# Altium project S7CAS-PLEIADES-CARTES-MERE_P07.PrjPcb (part 3 of 4)

## Sheet S7CAS-PLEIADES-CARTE-MERE_P07_DDR.SchDoc
size Tabloid; DocumentNumber: 11; SheetNumber: 11; SheetTotal: 16; Sheet_Name: DDR; Size: 11x17
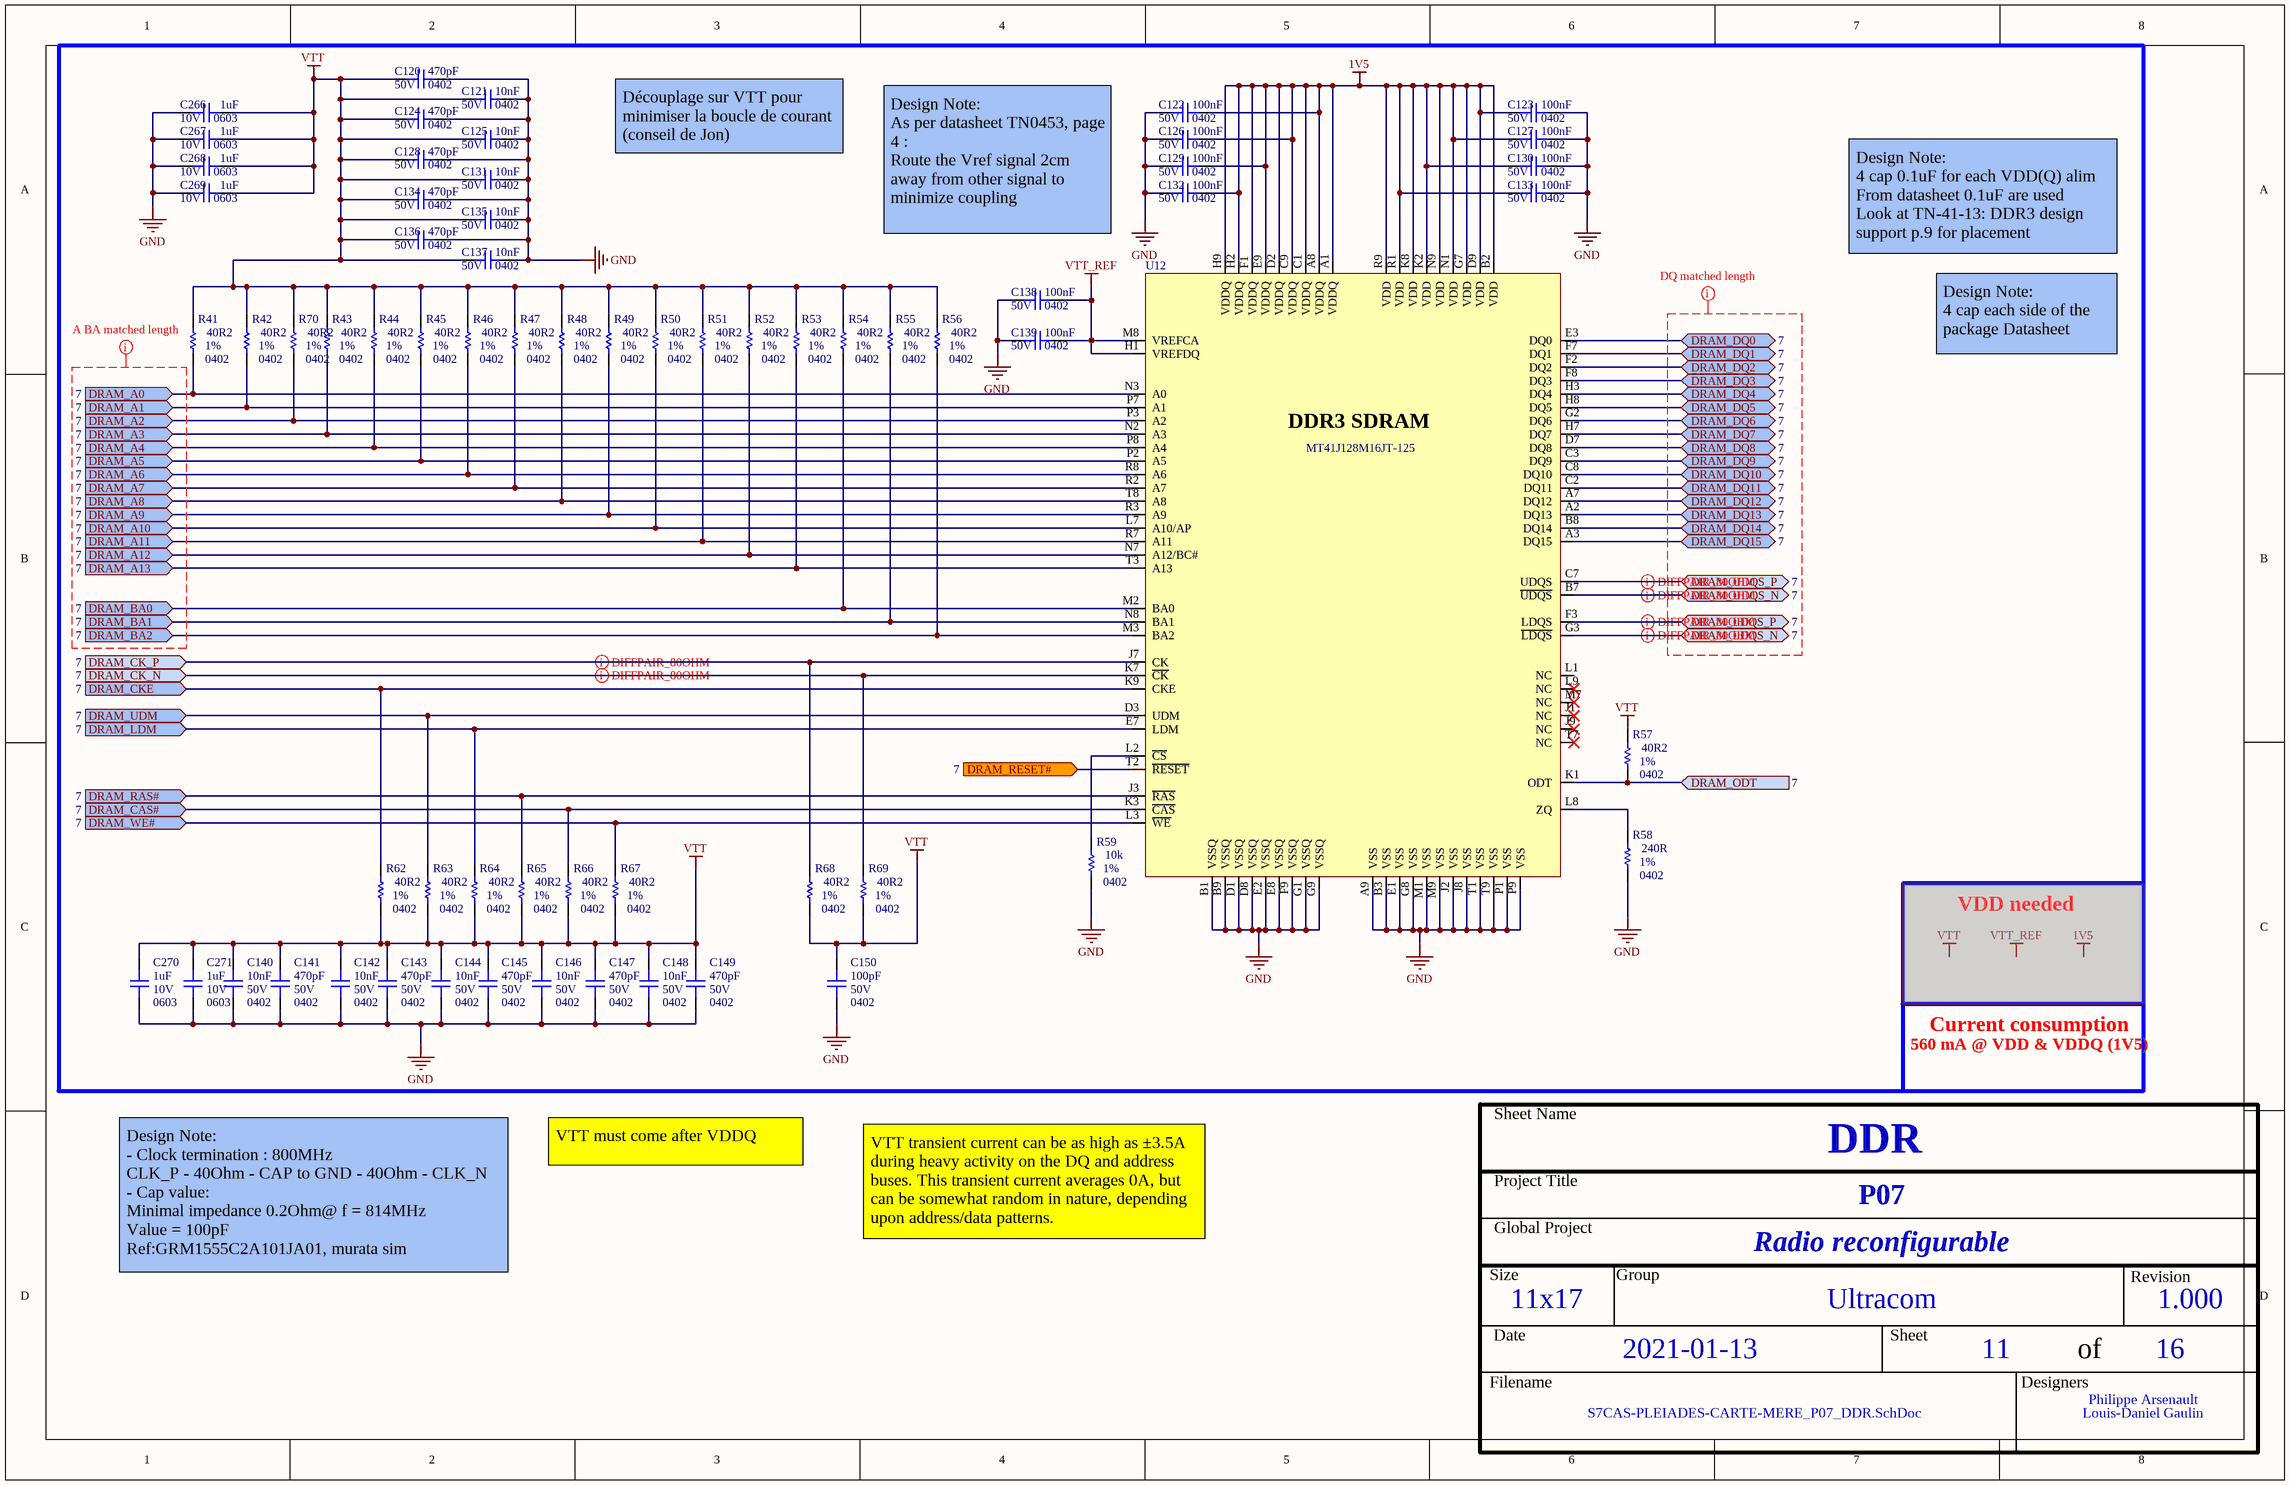
[diagram p10: S7CAS-PLEIADES-CARTE-MERE_P07_DDR.SchDoc]

### Parts
C120  value 470pF  Voltage: 50V  Package: 0402  [CAP_0402]  (hidden comment: CAP - 0402)
C121  value 10nF  Voltage: 50V  Package: 0402  [CAP_0402]  (hidden comment: CAP - 0402)
C122  value 100nF  Voltage: 50V  Package: 0402  [CAP_0402]  (hidden comment: CAP - 0402)
C123  value 100nF  Voltage: 50V  Package: 0402  [CAP_0402]  (hidden comment: CAP - 0402)
C124  value 470pF  Voltage: 50V  Package: 0402  [CAP_0402]  (hidden comment: CAP - 0402)
C125  value 10nF  Voltage: 50V  Package: 0402  [CAP_0402]  (hidden comment: CAP - 0402)
C126  value 100nF  Voltage: 50V  Package: 0402  [CAP_0402]  (hidden comment: CAP - 0402)
C127  value 100nF  Voltage: 50V  Package: 0402  [CAP_0402]  (hidden comment: CAP - 0402)
C128  value 470pF  Voltage: 50V  Package: 0402  [CAP_0402]  (hidden comment: CAP - 0402)
C129  value 100nF  Voltage: 50V  Package: 0402  [CAP_0402]  (hidden comment: CAP - 0402)
C130  value 100nF  Voltage: 50V  Package: 0402  [CAP_0402]  (hidden comment: CAP - 0402)
C131  value 10nF  Voltage: 50V  Package: 0402  [CAP_0402]  (hidden comment: CAP - 0402)
C132  value 100nF  Voltage: 50V  Package: 0402  [CAP_0402]  (hidden comment: CAP - 0402)
C133  value 100nF  Voltage: 50V  Package: 0402  [CAP_0402]  (hidden comment: CAP - 0402)
C134  value 470pF  Voltage: 50V  Package: 0402  [CAP_0402]  (hidden comment: CAP - 0402)
C135  value 10nF  Voltage: 50V  Package: 0402  [CAP_0402]  (hidden comment: CAP - 0402)
C136  value 470pF  Voltage: 50V  Package: 0402  [CAP_0402]  (hidden comment: CAP - 0402)
C137  value 10nF  Voltage: 50V  Package: 0402  [CAP_0402]  (hidden comment: CAP - 0402)
C138  value 100nF  Voltage: 50V  Package: 0402  [CAP_0402]  (hidden comment: CAP - 0402)
C139  value 100nF  Voltage: 50V  Package: 0402  [CAP_0402]  (hidden comment: CAP - 0402)
C140  value 10nF  Voltage: 50V  Package: 0402  [CAP_0402]  (hidden comment: CAP - 0402)
C141  value 470pF  Voltage: 50V  Package: 0402  [CAP_0402]  (hidden comment: CAP - 0402)
C142  value 10nF  Voltage: 50V  Package: 0402  [CAP_0402]  (hidden comment: CAP - 0402)
C143  value 470pF  Voltage: 50V  Package: 0402  [CAP_0402]  (hidden comment: CAP - 0402)
C144  value 10nF  Voltage: 50V  Package: 0402  [CAP_0402]  (hidden comment: CAP - 0402)
C145  value 470pF  Voltage: 50V  Package: 0402  [CAP_0402]  (hidden comment: CAP - 0402)
C146  value 10nF  Voltage: 50V  Package: 0402  [CAP_0402]  (hidden comment: CAP - 0402)
C147  value 470pF  Voltage: 50V  Package: 0402  [CAP_0402]  (hidden comment: CAP - 0402)
C148  value 10nF  Voltage: 50V  Package: 0402  [CAP_0402]  (hidden comment: CAP - 0402)
C149  value 470pF  Voltage: 50V  Package: 0402  [CAP_0402]  (hidden comment: CAP - 0402)
C150  value 100pF  Voltage: 50V  Package: 0402  [CAP_0402]  (hidden comment: CAP - 0402)
C266  value 1uF  Voltage: 10V  Package: 0603  [CAP_0603]  (hidden comment: CAP - 0603)
C267  value 1uF  Voltage: 10V  Package: 0603  [CAP_0603]  (hidden comment: CAP - 0603)
C268  value 1uF  Voltage: 10V  Package: 0603  [CAP_0603]  (hidden comment: CAP - 0603)
C269  value 1uF  Voltage: 10V  Package: 0603  [CAP_0603]  (hidden comment: CAP - 0603)
C270  value 1uF  Voltage: 10V  Package: 0603  [CAP_0603]  (hidden comment: CAP - 0603)
C271  value 1uF  Voltage: 10V  Package: 0603  [CAP_0603]  (hidden comment: CAP - 0603)
R41  value 40R2  Package: 0402  Precision: 1%  [RES_0402]  (hidden comment: RES - 0402)
R42  value 40R2  Package: 0402  Precision: 1%  [RES_0402]  (hidden comment: RES - 0402)
R43  value 40R2  Package: 0402  Precision: 1%  [RES_0402]  (hidden comment: RES - 0402)
R44  value 40R2  Package: 0402  Precision: 1%  [RES_0402]  (hidden comment: RES - 0402)
R45  value 40R2  Package: 0402  Precision: 1%  [RES_0402]  (hidden comment: RES - 0402)
R46  value 40R2  Package: 0402  Precision: 1%  [RES_0402]  (hidden comment: RES - 0402)
R47  value 40R2  Package: 0402  Precision: 1%  [RES_0402]  (hidden comment: RES - 0402)
R48  value 40R2  Package: 0402  Precision: 1%  [RES_0402]  (hidden comment: RES - 0402)
R49  value 40R2  Package: 0402  Precision: 1%  [RES_0402]  (hidden comment: RES - 0402)
R50  value 40R2  Package: 0402  Precision: 1%  [RES_0402]  (hidden comment: RES - 0402)
R51  value 40R2  Package: 0402  Precision: 1%  [RES_0402]  (hidden comment: RES - 0402)
R52  value 40R2  Package: 0402  Precision: 1%  [RES_0402]  (hidden comment: RES - 0402)
R53  value 40R2  Package: 0402  Precision: 1%  [RES_0402]  (hidden comment: RES - 0402)
R54  value 40R2  Package: 0402  Precision: 1%  [RES_0402]  (hidden comment: RES - 0402)
R55  value 40R2  Package: 0402  Precision: 1%  [RES_0402]  (hidden comment: RES - 0402)
R56  value 40R2  Package: 0402  Precision: 1%  [RES_0402]  (hidden comment: RES - 0402)
R57  value 40R2  Package: 0402  Precision: 1%  [RES_0402]  (hidden comment: RES - 0402)
R58  value 240R  Package: 0402  Precision: 1%  [RES_0402]  (hidden comment: RES - 0402)
R59  value 10k  Package: 0402  Precision: 1%  [RES_0402]  (hidden comment: RES - 0402)
R62  value 40R2  Package: 0402  Precision: 1%  [RES_0402]  (hidden comment: RES - 0402)
R63  value 40R2  Package: 0402  Precision: 1%  [RES_0402]  (hidden comment: RES - 0402)
R64  value 40R2  Package: 0402  Precision: 1%  [RES_0402]  (hidden comment: RES - 0402)
R65  value 40R2  Package: 0402  Precision: 1%  [RES_0402]  (hidden comment: RES - 0402)
R66  value 40R2  Package: 0402  Precision: 1%  [RES_0402]  (hidden comment: RES - 0402)
R67  value 40R2  Package: 0402  Precision: 1%  [RES_0402]  (hidden comment: RES - 0402)
R68  value 40R2  Package: 0402  Precision: 1%  [RES_0402]  (hidden comment: RES - 0402)
R69  value 40R2  Package: 0402  Precision: 1%  [RES_0402]  (hidden comment: RES - 0402)
R70  value 40R2  Package: 0402  Precision: 1%  [RES_0402]  (hidden comment: RES - 0402)
U12  MT41J128M16JT-125  [MEM_DDR3_MT41J128M16JT-125]

### Ports
DRAM_A0 (in, see 7), DRAM_A1 (in, see 7), DRAM_A2 (in, see 7), DRAM_A3 (in, see 7), DRAM_A4 (in, see 7), DRAM_A5 (in, see 7), DRAM_A6 (in, see 7), DRAM_A7 (in, see 7), DRAM_A8 (in, see 7), DRAM_A9 (in, see 7), DRAM_A10 (in, see 7), DRAM_A11 (in, see 7), DRAM_A12 (in, see 7), DRAM_A13 (in, see 7), DRAM_BA0 (in, see 7), DRAM_BA1 (in, see 7), DRAM_BA2 (in, see 7), DRAM_CAS# (in, see 7), DRAM_CK_N (in, see 7), DRAM_CK_P (in, see 7), DRAM_CKE (in, see 7), DRAM_DQ0 (bidir, see 7), DRAM_DQ1 (bidir, see 7), DRAM_DQ2 (bidir, see 7), DRAM_DQ3 (bidir, see 7), DRAM_DQ4 (bidir, see 7), DRAM_DQ5 (bidir, see 7), DRAM_DQ6 (bidir, see 7), DRAM_DQ7 (bidir, see 7), DRAM_DQ8 (bidir, see 7), DRAM_DQ9 (bidir, see 7), DRAM_DQ10 (bidir, see 7), DRAM_DQ11 (bidir, see 7), DRAM_DQ12 (bidir, see 7), DRAM_DQ13 (bidir, see 7), DRAM_DQ14 (bidir, see 7), DRAM_DQ15 (bidir, see 7), DRAM_LDM (in, see 7), DRAM_LDQS_N (bidir, see 7), DRAM_LDQS_P (bidir, see 7), DRAM_ODT (in, see 7), DRAM_RAS# (in, see 7), DRAM_RESET# (in, see 7), DRAM_UDM (in, see 7), DRAM_UDQS_N (bidir, see 7), DRAM_UDQS_P (bidir, see 7), DRAM_WE# (in, see 7)

### Nets
1V5: C122.1 C123.2 C126.1 C127.2 C129.1 C130.2 C132.1 C133.2 U12.A1(VDDQ) U12.A8(VDDQ) U12.B2(VDD) U12.C1(VDDQ) U12.C9(VDDQ) U12.D2(VDDQ) U12.D9(VDD) U12.E9(VDDQ) U12.F1(VDDQ) U12.G7(VDD) U12.H2(VDDQ) U12.H9(VDDQ) U12.K2(VDD) U12.K8(VDD) U12.N1(VDD) U12.N9(VDD) U12.R1(VDD) U12.R9(VDD)
GND: C120.1 C121.1 C122.2 C123.1 C124.1 C125.1 C126.2 C127.1 C128.1 C129.2 C130.1 C131.1 C132.2 C133.1 C134.1 C135.1 C136.1 C137.1 C138.2 C139.2 C140.1 C141.1 C142.1 C143.1 C144.1 C145.1 C146.1 C147.1 C148.1 C149.1 C150.1 C266.2 C267.2 C268.2 C269.2 C270.1 C271.1 R58.1 R59.1 U12.A9(VSS) U12.B1(VSSQ) U12.B3(VSS) U12.B9(VSSQ) U12.D1(VSSQ) U12.D8(VSSQ) U12.E1(VSS) U12.E2(VSSQ) U12.E8(VSSQ) U12.F9(VSSQ) U12.G1(VSSQ) U12.G8(VSS) U12.G9(VSSQ) U12.J2(VSS) U12.J8(VSS) U12.M1(VSS) U12.M9(VSS) U12.P1(VSS) U12.P9(VSS) U12.T1(VSS) U12.T9(VSS)
VTT: C120.2 C121.2 C124.2 C125.2 C128.2 C131.2 C134.2 C135.2 C136.2 C137.2 C140.2 C141.2 C142.2 C143.2 C144.2 C145.2 C146.2 C147.2 C148.2 C149.2 C150.2 C266.1 C267.1 C268.1 C269.1 C270.2 C271.2 R41.2 R42.2 R43.2 R44.2 R45.2 R46.2 R47.2 R48.2 R49.2 R50.2 R51.2 R52.2 R53.2 R54.2 R55.2 R56.2 R57.2 R62.1 R63.1 R64.1 R65.1 R66.1 R67.1 R68.1 R69.1 R70.2
VTT_REF: C138.1 C139.1 U12.H1(VREFDQ) U12.M8(VREFCA)
DRAM_A0: R41.1 U12.N3(A0) ; port DRAM_A0
DRAM_A1: R42.1 U12.P7(A1) ; port DRAM_A1
DRAM_A2: R70.1 U12.P3(A2) ; port DRAM_A2
DRAM_A3: R43.1 U12.N2(A3) ; port DRAM_A3
DRAM_A4: R44.1 U12.P8(A4) ; port DRAM_A4
DRAM_A5: R45.1 U12.P2(A5) ; port DRAM_A5
DRAM_A6: R46.1 U12.R8(A6) ; port DRAM_A6
DRAM_A7: R47.1 U12.R2(A7) ; port DRAM_A7
DRAM_A8: R48.1 U12.T8(A8) ; port DRAM_A8
DRAM_A9: R49.1 U12.R3(A9) ; port DRAM_A9
DRAM_A10: R50.1 U12.L7(A10/AP) ; port DRAM_A10
DRAM_A11: R51.1 U12.R7(A11) ; port DRAM_A11
DRAM_A12: R52.1 U12.N7(A12/BC#) ; port DRAM_A12
DRAM_A13: R53.1 U12.T3(A13) ; port DRAM_A13
DRAM_BA0: R54.1 U12.M2(BA0) ; port DRAM_BA0
DRAM_BA1: R55.1 U12.N8(BA1) ; port DRAM_BA1
DRAM_BA2: R56.1 U12.M3(BA2) ; port DRAM_BA2
DRAM_CAS#: R66.2 U12.K3(~{CAS}) ; port DRAM_CAS#
DRAM_CK_N: R69.2 U12.K7(~{CK}) ; port DRAM_CK_N
DRAM_CK_P: R68.2 U12.J7(CK) ; port DRAM_CK_P
DRAM_CKE: R62.2 U12.K9(CKE) ; port DRAM_CKE
DRAM_DQ0: U12.E3(DQ0) ; port DRAM_DQ0
DRAM_DQ1: U12.F7(DQ1) ; port DRAM_DQ1
DRAM_DQ2: U12.F2(DQ2) ; port DRAM_DQ2
DRAM_DQ3: U12.F8(DQ3) ; port DRAM_DQ3
DRAM_DQ4: U12.H3(DQ4) ; port DRAM_DQ4
DRAM_DQ5: U12.H8(DQ5) ; port DRAM_DQ5
DRAM_DQ6: U12.G2(DQ6) ; port DRAM_DQ6
DRAM_DQ7: U12.H7(DQ7) ; port DRAM_DQ7
DRAM_DQ8: U12.D7(DQ8) ; port DRAM_DQ8
DRAM_DQ9: U12.C3(DQ9) ; port DRAM_DQ9
DRAM_DQ10: U12.C8(DQ10) ; port DRAM_DQ10
DRAM_DQ11: U12.C2(DQ11) ; port DRAM_DQ11
DRAM_DQ12: U12.A7(DQ12) ; port DRAM_DQ12
DRAM_DQ13: U12.A2(DQ13) ; port DRAM_DQ13
DRAM_DQ14: U12.B8(DQ14) ; port DRAM_DQ14
DRAM_DQ15: U12.A3(DQ15) ; port DRAM_DQ15
DRAM_LDM: R64.2 U12.E7(LDM) ; port DRAM_LDM
DRAM_LDQS_N: U12.G3(~{LDQS}) ; port DRAM_LDQS_N
DRAM_LDQS_P: U12.F3(LDQS) ; port DRAM_LDQS_P
DRAM_ODT: R57.1 U12.K1(ODT) ; port DRAM_ODT
DRAM_RAS#: R65.2 U12.J3(~{RAS}) ; port DRAM_RAS#
DRAM_RESET#: U12.T2(~{RESET}) ; port DRAM_RESET#
DRAM_UDM: R63.2 U12.D3(UDM) ; port DRAM_UDM
DRAM_UDQS_N: U12.B7(~{UDQS}) ; port DRAM_UDQS_N
DRAM_UDQS_P: U12.C7(UDQS) ; port DRAM_UDQS_P
DRAM_WE#: R67.2 U12.L3(~{WE}) ; port DRAM_WE#
NetR58_2: R58.2 U12.L8(ZQ)
NetR59_2: R59.2 U12.L2(~{CS})

Not connected (* = marked no-connect by the designer): U12 J1(NC)* J9(NC)* L1(NC) L9(NC)* M7(NC)* T7(NC)*

### Layout directives
differential pair; differential pair class DIFF_80_OHM: DRAM_CK_N, DRAM_CK_P, DRAM_LDQS_N, DRAM_LDQS_P, DRAM_UDQS_N, DRAM_UDQS_P
rule Matched Net Lengths [Tolerance = 1mil]; net class DDR_DQ: (no net found under the mark)
rule Matched Net Lengths [Tolerance = 1mil]; net class DDR_ADDR: (no net found under the mark)

### Notes on the sheet
- Découplage sur VTT pour minimiser la boucle de courant (conseil de Jon)
- Design Note:
  As per datasheet TN0453, page 4 :
  Route the Vref signal 2cm away from other signal to minimize coupling
- Design Note:
  4 cap 0.1uF for each VDD(Q) alim
  From datasheet 0.1uF are used
  Look at TN-41-13: DDR3 design support p.9 for placement
- Design Note:
  4 cap each side of the package Datasheet
- VDD needed
- Current consumption
- 560 mA @ VDD & VDDQ (1V5)
- VTT must come after VDDQ
- VTT transient current can be as high as ±3.5A during heavy activity on the DQ and address buses. This transient current averages 0A, but can be somewhat random in nature, depending upon address/data patterns.
- Design Note:
  - Clock termination : 800MHz
  CLK_P - 40Ohm - CAP to GND - 40Ohm - CLK_N
  - Cap value:
  Minimal impedance 0.2Ohm@ f = 814MHz
  Value = 100pF
  Ref:GRM1555C2A101JA01, murata sim
- Sheet Name
- Project Title
- Global Project
- Size
- Group
- Revision
- Date
- Sheet
- of
- Filename
- Designers
- (in symbol MEM_DDR3_MT41J128M16JT-125:K TR) DDR3 SDRAM

### Library data of the parts
C120-C150 = CAP - 0402: Precision: 10%; Current: *; CreatedBy: Jonathan Bouchard; Power: *
C266-C271 = CAP - 0603: Precision: 10%; Current: *; CreatedBy: Jonathan Bouchard; Power: *
R41-R59 R62-R70 = RES - 0402: Voltage: 50V; Power: 1/16W; Current: *; CreatedBy: Jonathan Bouchard
U12 = MEM_DDR3_MT41J128M16JT-125:K TR: MEM - DDR3 SDRAM 2GBIT 800MHZ - TFBGA-96; Voltage: 1.425 V ~ 1.575 V; Mfg: Micrel; Current: *; Power: *; Mfg Part Number: http://www.micron.com/~/media/Documents/Products/Data%20Sheet/DRAM/DDR3/2Gb_DDR3_SDRAM.pdf; HelpURL: http://ww1.microchip.com/downloads/en/DeviceDoc/00002275A.pdf; CreatedBy: Jonathan Bouchard; Temperature: 0°C ~ 95°C (TC); Value: *; Precision: *; Package: TFBGA-96; Supplier 1: Digikey; Supplier Part Number 1: 557-1611-1-ND

## Sheet S7CAS-PLEIADES-CARTE-MERE_P07_USB.SchDoc
size Tabloid; DocumentNumber: 12; SheetNumber: 12; SheetTotal: 16; Sheet_Name: USB; Size: 11x17
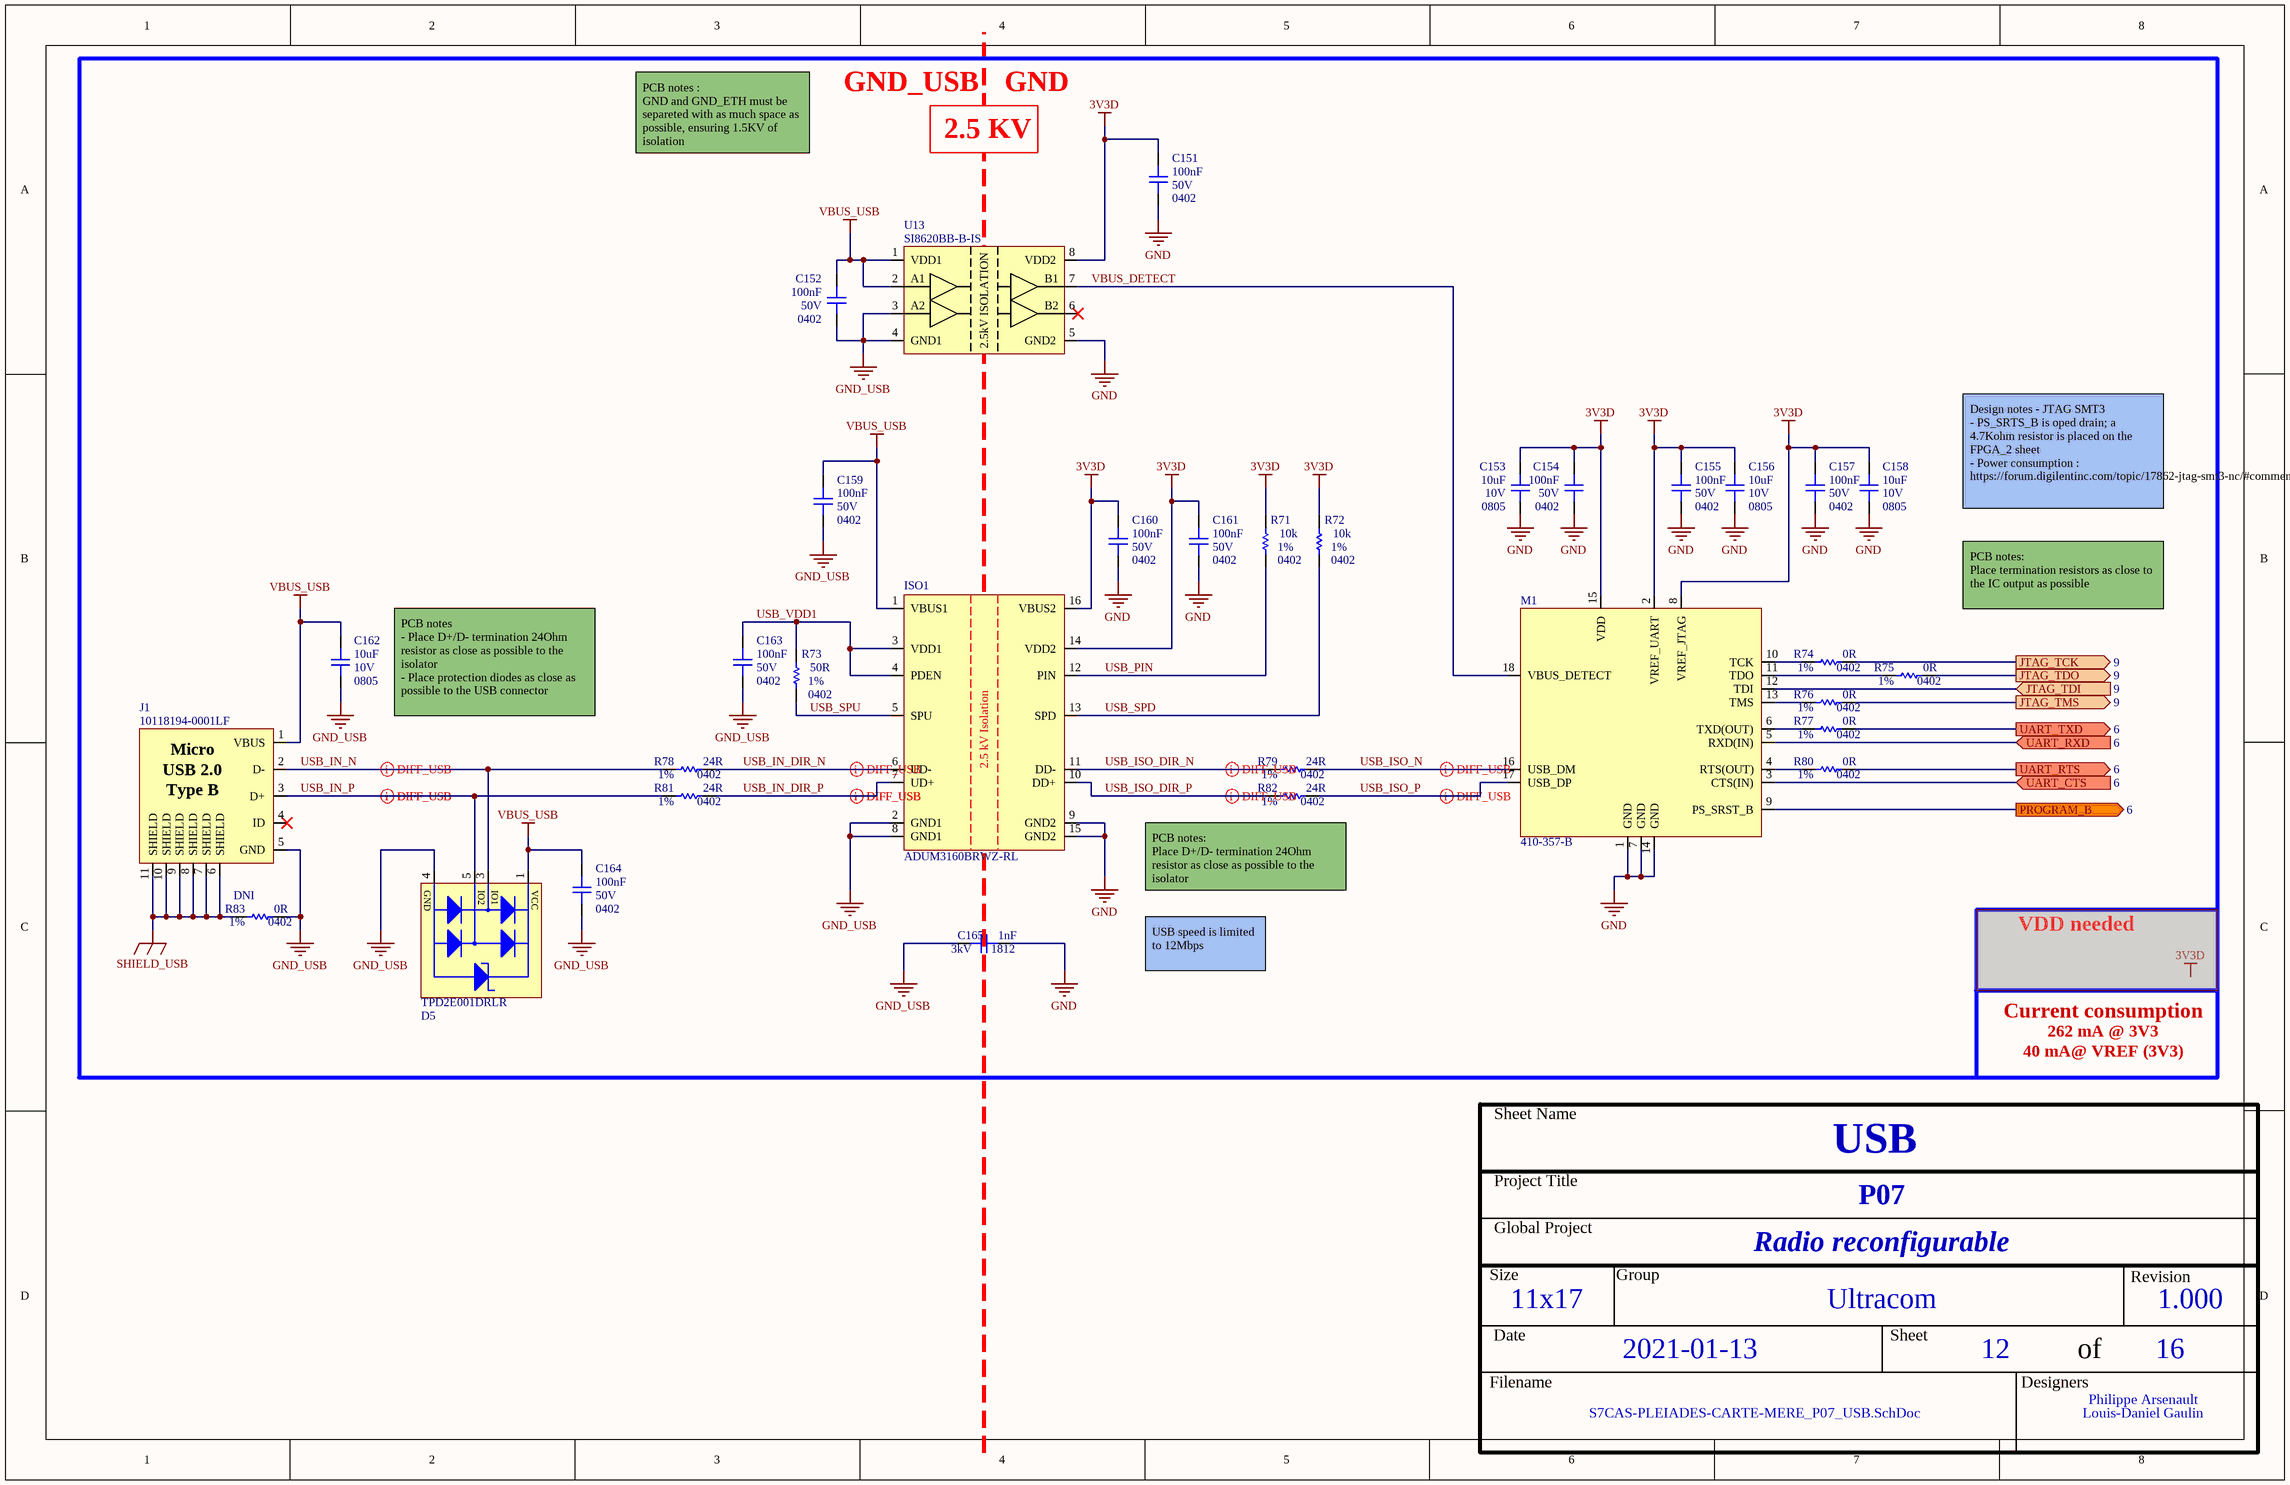
[diagram p11: S7CAS-PLEIADES-CARTE-MERE_P07_USB.SchDoc]

### Parts
C151  value 100nF  Voltage: 50V  Package: 0402  [CAP_0402]  (hidden comment: CAP - 0402)
C152  value 100nF  Voltage: 50V  Package: 0402  [CAP_0402]  (hidden comment: CAP - 0402)
C153  value 10uF  Voltage: 10V  Package: 0805  [CAP_0805]  (hidden comment: CAP - 0805)
C154  value 100nF  Voltage: 50V  Package: 0402  [CAP_0402]  (hidden comment: CAP - 0402)
C155  value 100nF  Voltage: 50V  Package: 0402  [CAP_0402]  (hidden comment: CAP - 0402)
C156  value 10uF  Voltage: 10V  Package: 0805  [CAP_0805]  (hidden comment: CAP - 0805)
C157  value 100nF  Voltage: 50V  Package: 0402  [CAP_0402]  (hidden comment: CAP - 0402)
C158  value 10uF  Voltage: 10V  Package: 0805  [CAP_0805]  (hidden comment: CAP - 0805)
C159  value 100nF  Voltage: 50V  Package: 0402  [CAP_0402]  (hidden comment: CAP - 0402)
C160  value 100nF  Voltage: 50V  Package: 0402  [CAP_0402]  (hidden comment: CAP - 0402)
C161  value 100nF  Voltage: 50V  Package: 0402  [CAP_0402]  (hidden comment: CAP - 0402)
C162  value 10uF  Voltage: 10V  Package: 0805  [CAP_0805]  (hidden comment: CAP - 0805)
C163  value 100nF  Voltage: 50V  Package: 0402  [CAP_0402]  (hidden comment: CAP - 0402)
C164  value 100nF  Voltage: 50V  Package: 0402  [CAP_0402]  (hidden comment: CAP - 0402)
C165  value 1nF  Voltage: 3kV  Package: 1812  [CAP_1812]  (hidden comment: CAP - 1812)
D5  TPD2E001DRLR  [TVS_USB_TPD2E001DRLR]
ISO1  ADUM3160BRWZ-RL  [ISO_ADUM3160BRWZ-RL]
J1  10118194-0001LF  [CON_USB_10118194-0001LF]
M1  410-357-B  [MOD_JTAG_410-357-B]
R71  value 10k  Package: 0402  Precision: 1%  [RES_0402]  (hidden comment: RES - 0402)
R72  value 10k  Package: 0402  Precision: 1%  [RES_0402]  (hidden comment: RES - 0402)
R73  value 50R  Package: 0402  Precision: 1%  [RES_0402]  (hidden comment: RES - 0402)
R74  value 0R  Package: 0402  Precision: 1%  [RES_0402]  (hidden comment: RES - 0402)
R75  value 0R  Package: 0402  Precision: 1%  [RES_0402]  (hidden comment: RES - 0402)
R76  value 0R  Package: 0402  Precision: 1%  [RES_0402]  (hidden comment: RES - 0402)
R77  value 0R  Package: 0402  Precision: 1%  [RES_0402]  (hidden comment: RES - 0402)
R78  value 24R  Package: 0402  Precision: 1%  [RES_0402]  (hidden comment: RES - 0402)
R79  value 24R  Package: 0402  Precision: 1%  [RES_0402]  (hidden comment: RES - 0402)
R80  value 0R  Package: 0402  Precision: 1%  [RES_0402]  (hidden comment: RES - 0402)
R81  value 24R  Package: 0402  Precision: 1%  [RES_0402]  (hidden comment: RES - 0402)
R82  value 24R  Package: 0402  Precision: 1%  [RES_0402]  (hidden comment: RES - 0402)
R83  value 0R  Package: 0402  Precision: 1%  Assembly note: DNI  [RES_0402]  (hidden comment: RES - 0402)
U13  SI8620BB-B-IS  [ISO_SI8620BB-B-IS]

### Ports
JTAG_TCK (out, see 9), JTAG_TDI (in, see 9), JTAG_TDO (out, see 9), JTAG_TMS (out, see 9), PROGRAM_B (out, see 6), UART_CTS (in, see 6), UART_RTS (out, see 6), UART_RXD (in, see 6), UART_TXD (out, see 6)

### Nets
3V3D: C151.2 C153.2 C154.2 C155.2 C156.2 C157.2 C158.2 C160.2 C161.2 ISO1.14(VDD2) ISO1.16(VBUS2) M1.2(VREF_UART) M1.8(VREF_JTAG) M1.15(VDD) R71.2 R72.2 U13.8(VDD2)
GND: C151.1 C153.1 C154.1 C155.1 C156.1 C157.1 C158.1 C160.1 C161.1 C165.1 ISO1.9(GND2) ISO1.15(GND2) M1.1(GND) M1.7(GND) M1.14(GND) U13.5(GND2)
GND_USB: C152.1 C159.1 C162.1 C163.1 C164.1 C165.2 D5.4(GND) ISO1.2(GND1) ISO1.8(GND1) J1.5(GND) R83.1 U13.3(A2) U13.4(GND1)
SHIELD_USB: J1.6(SHIELD) J1.7(SHIELD) J1.8(SHIELD) J1.9(SHIELD) J1.10(SHIELD) J1.11(SHIELD) R83.2
VBUS_USB: C152.2 C159.2 C162.2 C164.2 D5.1(VCC) ISO1.1(VBUS1) J1.1(VBUS) U13.1(VDD1) U13.2(A1)
JTAG_TCK: R74.1 ; port JTAG_TCK
JTAG_TDI: M1.12(TDI) ; port JTAG_TDI
JTAG_TDO: R75.1 ; port JTAG_TDO
JTAG_TMS: R76.1 ; port JTAG_TMS
PROGRAM_B: M1.9(PS_SRST_B) ; port PROGRAM_B
UART_CTS: M1.3(CTS(IN)) ; port UART_CTS
UART_RTS: R80.1 ; port UART_RTS
UART_RXD: M1.5(RXD(IN)) ; port UART_RXD
UART_TXD: R77.1 ; port UART_TXD
USB_IN_DIR_N: ISO1.6(UD-) R78.1
USB_IN_DIR_P: ISO1.7(UD+) R81.1
USB_IN_N: D5.3(IO1) J1.2(D-) R78.2
USB_IN_P: D5.5(IO2) J1.3(D+) R81.2
USB_ISO_DIR_N: ISO1.11(DD-) R79.2
USB_ISO_DIR_P: ISO1.10(DD+) R82.2
USB_ISO_N: M1.16(USB_DM) R79.1
USB_ISO_P: M1.17(USB_DP) R82.1
USB_PIN: ISO1.12(PIN) R71.1
USB_SPD: ISO1.13(SPD) R72.1
USB_SPU: ISO1.5(SPU) R73.1
USB_VDD1: C163.2 ISO1.3(VDD1) ISO1.4(PDEN) R73.2
VBUS_DETECT: M1.18(VBUS_DETECT) U13.7(B1)
NetM1_4: M1.4(RTS(OUT)) R80.2
NetM1_6: M1.6(TXD(OUT)) R77.2
NetM1_10: M1.10(TCK) R74.2
NetM1_11: M1.11(TDO) R75.2
NetM1_13: M1.13(TMS) R76.2

Not connected (* = marked no-connect by the designer): D5 2(NC); J1 4(ID)*; U13 6(B2)*

### Layout directives
differential pair; differential pair class DIFF_90OHM: USB_IN_DIR_N, USB_IN_DIR_P, USB_IN_N, USB_IN_P, USB_ISO_DIR_N, USB_ISO_DIR_P, USB_ISO_N, USB_ISO_P

### Notes on the sheet
- GND_USB
- GND
- PCB notes :
  GND and GND_ETH must be separeted with as much space as possible, ensuring 1.5KV of isolation
- 2.5 KV
- Design notes - JTAG SMT3
  - PS_SRTS_B is oped drain; a 4.7Kohm resistor is placed on the FPGA_2 sheet
  - Power consumption : https://forum.digilentinc.com/topic/17862-jtag-smt3-nc/#comment-45773
- PCB notes:
  Place termination resistors as close to the IC output as possible
- PCB notes
  - Place D+/D- termination 24Ohm resistor as close as possible to the isolator
  - Place protection diodes as close as possible to the USB connector
- (near R82) PCB notes:
  Place D+/D- termination 24Ohm resistor as close as possible to the isolator
- USB speed is limited to 12Mbps
- VDD needed
- 262 mA @ 3V3
- Current consumption
- 40 mA@ VREF (3V3)
- Sheet Name
- Project Title
- Global Project
- Size
- Group
- Revision
- Date
- Sheet
- of
- Filename
- Designers
- (in symbol CON_USB_10118194-0001LF) Micro; USB 2.0; Type B
- (in symbol ISO_ADUM3160BRWZ-RL) 2.5 kV Isolation
- (in symbol ISO_SI8620BB-B-IS) 2.5kV ISOLATION

### Library data of the parts
C151 C152 C154 C155 C157 C159-C161 C163 C164 = CAP - 0402: Precision: 10%; Current: *; CreatedBy: Jonathan Bouchard; Power: *
C153 C156 C158 C162 = CAP - 0805: Mfg: CL21B106KPQNNNE; Precision: 10%; Current: *; CreatedBy: Jonathan Bouchard; Power: *
C165 = CAP - 1812: Mfg Part Number: 1812HC102MAT1A; Precision: 10%; Current: *; CreatedBy: Jonathan Bouchard; Power: *
D5 = TVS_USB_TPD2E001DRLR: TVS - USB TVS DIODE 5.5V - SOT-553; Manufacturer #1: Texas Instruments; Value: 11V Breakdown; Voltage Rating: 5.5V (Max); GRAMS Lib Spec: 2.8; Magnetic Material: YES; Cryo: UNKNOWN; Tolerance: *; Current Rating: *; Power Max: *; HelpURL: http://www.ti.com/lit/ds/symlink/tpd2e001.pdf; CreatedBy/Date: Jonathan Bouchard 2018-07-10; VerifiedBy: Arnaud Samson 16-07-18; Temperature: -40°C ~ 85°C (TA); Package: SOT-553; Manufacturer #2: *; Note: *; Assembly Type: SMD; Part Number #2: *; Part Number #1: TPD2E001DRLR; Polarized: YES; Supplier 1: Digi-Key; Supplier Part Number 1: 296-21883-1-ND
ISO1 = ISO_ADUM3160BRWZ-RL: ISO - DGTL ISO 2.5KV 2CH USB - 16SOIC; Manufacturer #1: Analog Devices; Value: 2500Vrms voltage isolation; Voltage Rating: 3~5.5V; GRAMS Lib Spec: 2.8; Magnetic Material: UNKNOWN; Polarized: Yes; Tolerance: *; Current Rating: *; Power Max: *; HelpURL: https://www.analog.com/media/en/technical-documentation/data-sheets/ADuM3160.pdf; CreatedBy/Date: Tommy Rossignol 2018-11-16; VerifiedBy: Caroline Paulin - 13 février 2019; Temperature: -40°C ~ 105°C; Package: 16-SOIC; Manufacturer #2: *; Assembly Type: SMD; Part Number #2: *; Part Number #1: ADUM3160BRWZ-RL; Supplier 1: Digi-Key; Supplier Part Number 1: ADUM3160BRWZ-RLCT-ND; Cryo: UNKNOWN
J1 = CON_USB_10118194-0001LF: CON - USB MICRO B RECPT SMT R/A - 4PIN; Manufacturer #1: Amphenol FCI; Value: USB - Micro B; Voltage Rating: 100VAC; Current Rating: 1.8A; GRAMS Lib Spec: 2.8; Magnetic Material: YES; Cryo: UNKNOWN; Tolerance: *; Power Max: *; HelpURL: https://cdn.amphenol-icc.com/media/wysiwyg/files/drawing/10118194.pdf; CreatedBy/Date: Arnaud Samson - 09/07/18; VerifiedBy: Jonathan Bouchard 2018-07-12; Temperature: -30°C ~ 80°C; Package: 5-SMD; Manufacturer #2: *; Note: *; Assembly Type: SMD; Part Number #2: *; Part Number #1: 10118194-0001LF; Polarized: YES; Supplier 1: Digi-Key; Supplier Part Number 1: 609-4618-1-ND
M1 = MOD_JTAG_410-357-B: MOD - JTAG-SMT3-NC Programming Module For Xilinx FPGA - 18-SMT; Manufacturer #1: Digilent; Voltage Rating: VDD: 2.97V~3.63V, VJTAG/VUART: 1.65V~5.5V; GRAMS Lib Spec: 2.8; Note: Prior to reflow, the JTAG-SMT3-NC module must be dried at 125°C for 17 hours; Magnetic Material: Unknown; Polarized: Yes; Value: *; Tolerance: *; Current Rating: *; Power Max: *; HelpURL: https://reference.digilentinc.com/_media/reference/programmers/jtag-smt3/jtag-smt3-nc_rm.pdf; CreatedBy/Date: Tommy Rossignol 2018-11-23; VerifiedBy: Nicolas V. (2019-01-28); Temperature: -40°C ~ 85°C; Package: 18-pad SMT; Manufacturer #2: *; Assembly Type: SMD; Part Number #2: *; Part Number #1: 410-357-B; Supplier 1: Digi-Key; Supplier Part Number 1: 1286-1196-ND; Cryo: UNKNOWN
R71-R83 = RES - 0402: Voltage: 50V; Power: 1/16W; Current: *; CreatedBy: Jonathan Bouchard
U13 = ISO_SI8620BB-B-IS: ISO - Dual-Channel Digital Isolator (default Low) - 8-SOIC; Manufacturer #1: Silicon Labs; Voltage Rating: 2.5-5.5V; GRAMS Lib Spec: 2.8; Magnetic Material: Unknown; Polarized: Yes; Value: *; Tolerance: *; Current Rating: *; Power Max: *; HelpURL: https://www.silabs.com/documents/public/data-sheets/si861x-2x-datasheet.pdf; CreatedBy/Date: Joel Lemay 2018-06-05; VerifiedBy: Caroline Paulin - 12 sept 2018; Temperature: -40°C ~ 125°C; Package: 8-SOIC; Manufacturer #2: *; Assembly Type: SMD; Part Number #2: *; Part Number #1: SI8620BB-B-IS; Supplier 1: Digi-Key; Supplier Part Number 1: 336-2567-ND; Cryo: UNKNOWN

## Sheet S7CAS-PLEIADES-CARTE-MERE_P07_MOT.SchDoc
size Tabloid; DocumentNumber: 13; SheetNumber: 13; SheetTotal: 16; Sheet_Name: MOT; Size: 11x17
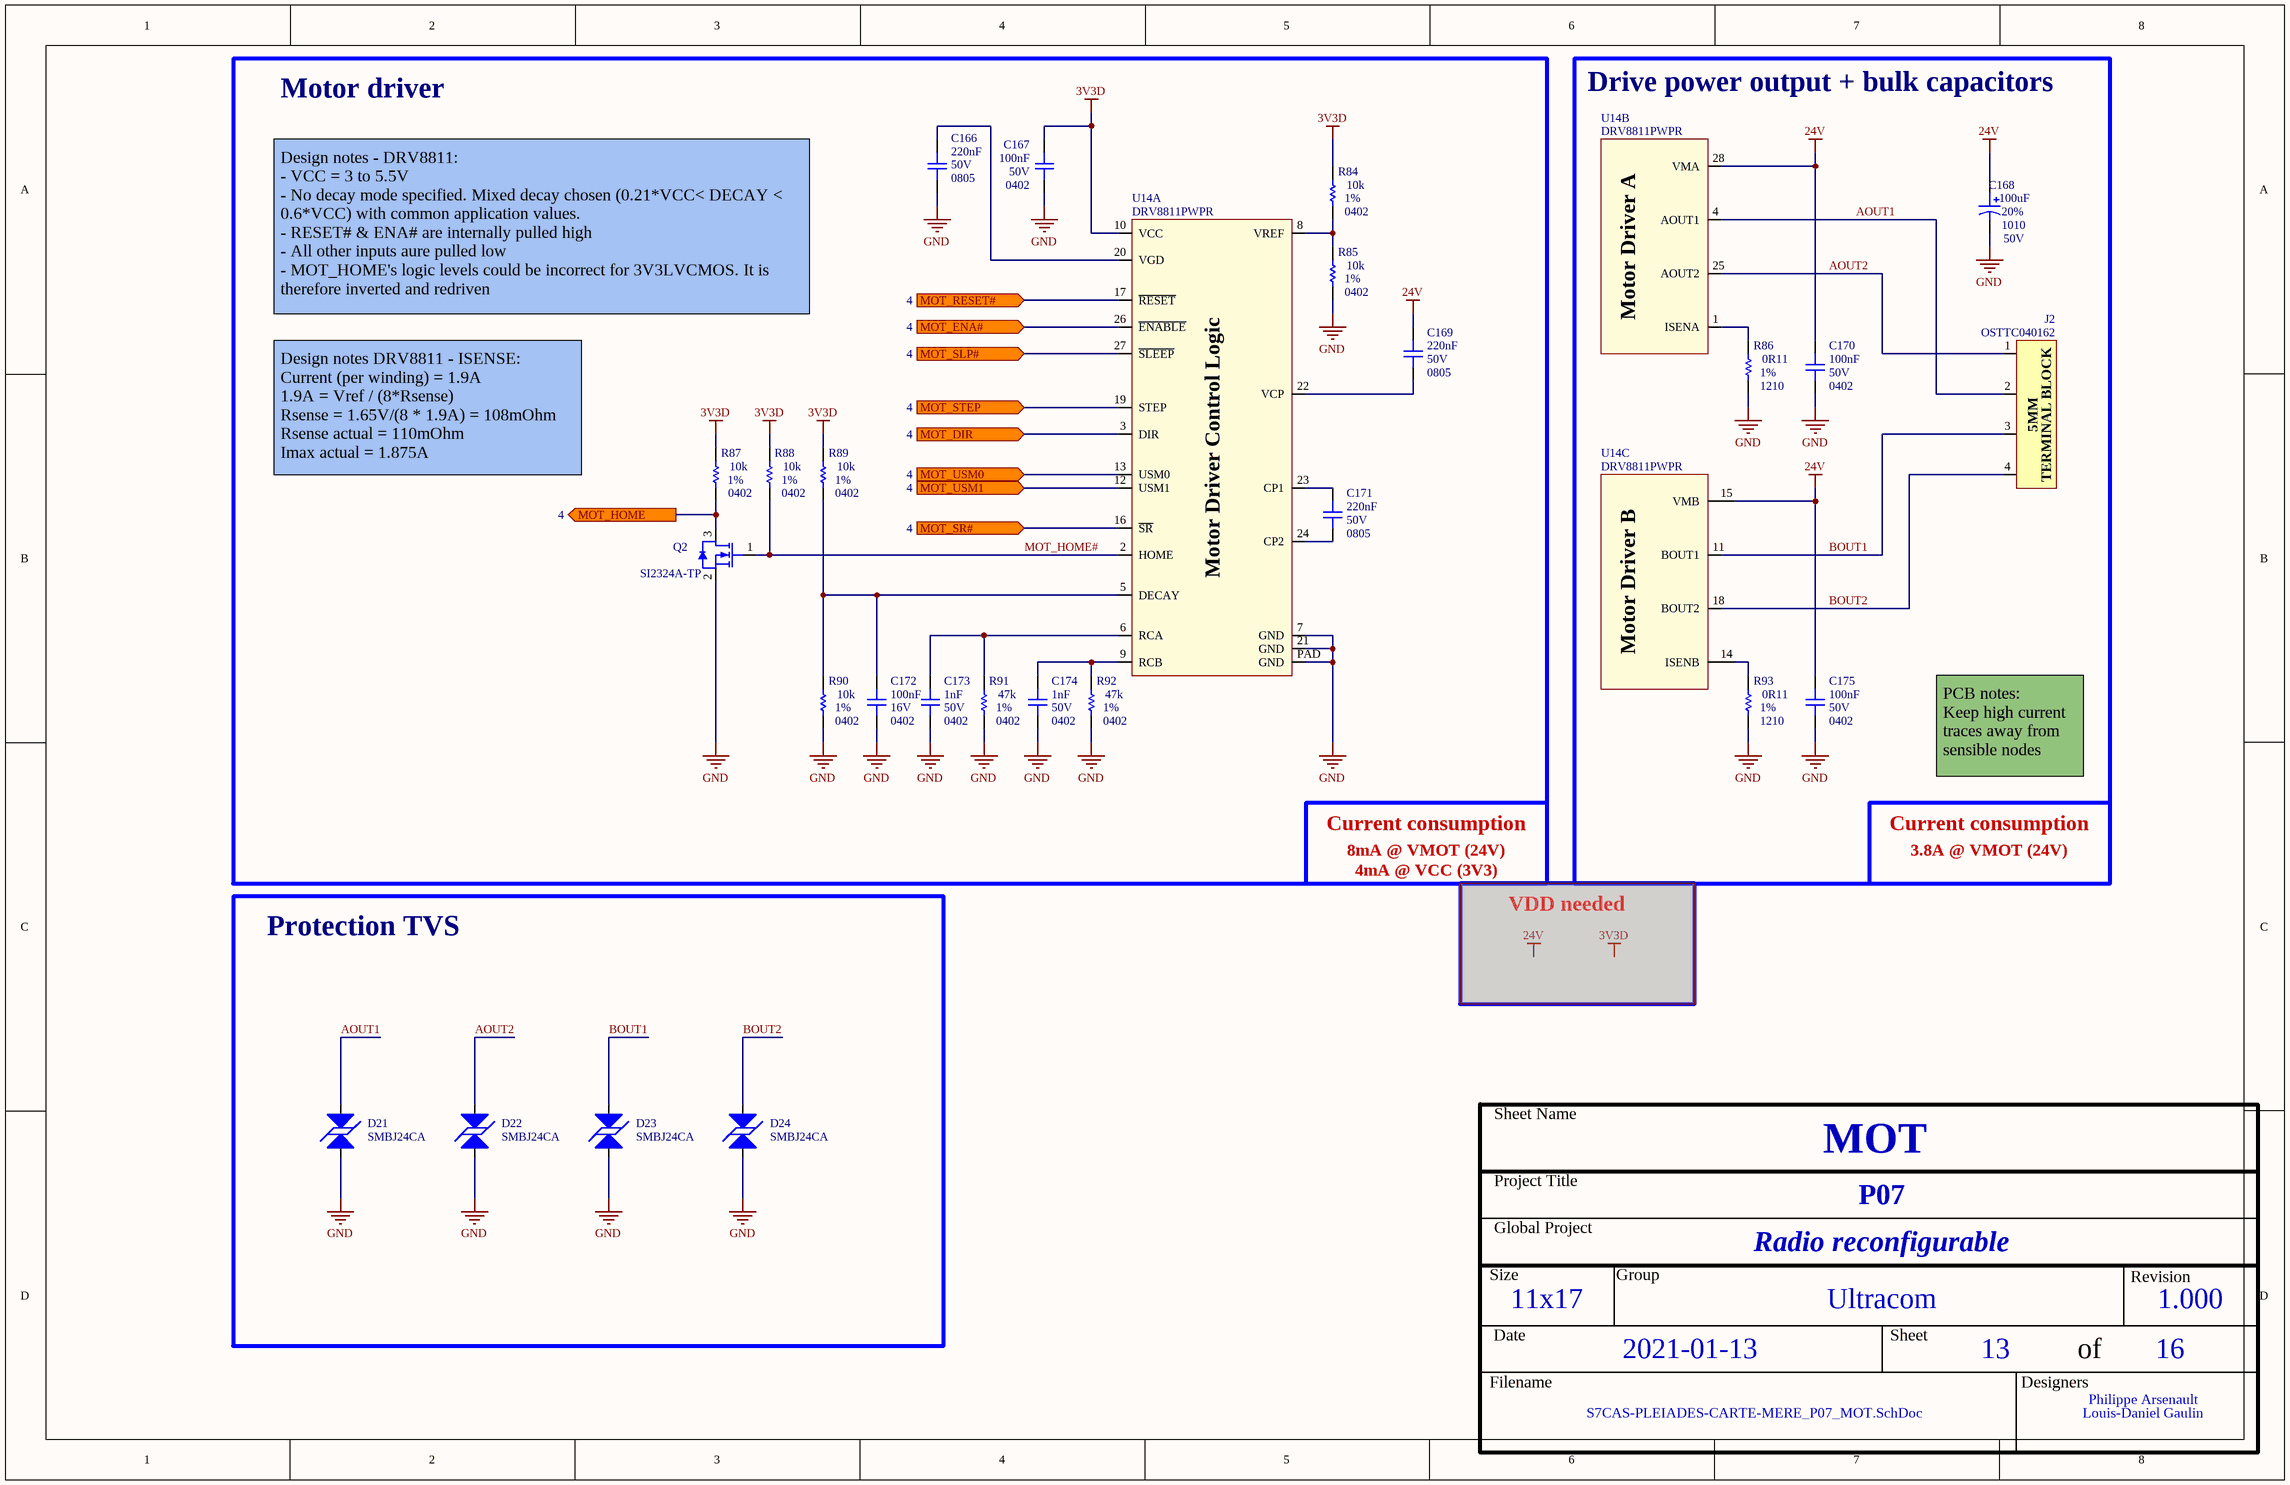
[diagram p12: S7CAS-PLEIADES-CARTE-MERE_P07_MOT.SchDoc]

### Parts
C166  value 220nF  Voltage: 50V  Package: 0805  [CAP_0805]  (hidden comment: CAP - 0805)
C167  value 100nF  Voltage: 50V  Package: 0402  [CAP_0402]  (hidden comment: CAP - 0402)
C168  value 100uF  Voltage: 50V  Package: 1010  Precision: 20%  [CAP_ALU_1010_vishay]  (hidden comment: MAL215099101E3)
C169  value 220nF  Voltage: 50V  Package: 0805  [CAP_0805]  (hidden comment: CAP - 0805)
C170  value 100nF  Voltage: 50V  Package: 0402  [CAP_0402]  (hidden comment: CAP - 0402)
C171  value 220nF  Voltage: 50V  Package: 0805  [CAP_0805]  (hidden comment: CAP - 0805)
C172  value 100nF  Voltage: 16V  Package: 0402  [CAP_0402]  (hidden comment: CAP - 0402)
C173  value 1nF  Voltage: 50V  Package: 0402  [CAP_0402]  (hidden comment: CAP - 0402)
C174  value 1nF  Voltage: 50V  Package: 0402  [CAP_0402]  (hidden comment: CAP - 0402)
C175  value 100nF  Voltage: 50V  Package: 0402  [CAP_0402]  (hidden comment: CAP - 0402)
D21  SMBJ24CA  [TVS_PWR_SMBJ36CA]
D22  SMBJ24CA  [TVS_PWR_SMBJ36CA]
D23  SMBJ24CA  [TVS_PWR_SMBJ36CA]
D24  SMBJ24CA  [TVS_PWR_SMBJ36CA]
J2  OSTTC040162  [CONN_TERMINAL_OSTTA040161]
Q2  SI2324A-TP  [TRX_NMOS_SI324A-TP]
R84  value 10k  Package: 0402  Precision: 1%  [RES_0402]  (hidden comment: RES - 0402)
R85  value 10k  Package: 0402  Precision: 1%  [RES_0402]  (hidden comment: RES - 0402)
R86  value 0R11  Package: 1210  Precision: 1%  [RES_1210]  (hidden comment: RES - 1210)
R87  value 10k  Package: 0402  Precision: 1%  [RES_0402]  (hidden comment: RES - 0402)
R88  value 10k  Package: 0402  Precision: 1%  [RES_0402]  (hidden comment: RES - 0402)
R89  value 10k  Package: 0402  Precision: 1%  [RES_0402]  (hidden comment: RES - 0402)
R90  value 10k  Package: 0402  Precision: 1%  [RES_0402]  (hidden comment: RES - 0402)
R91  value 47k  Package: 0402  Precision: 1%  [RES_0402]  (hidden comment: RES - 0402)
R92  value 47k  Package: 0402  Precision: 1%  [RES_0402]  (hidden comment: RES - 0402)
R93  value 0R11  Package: 1210  Precision: 1%  [RES_1210]  (hidden comment: RES - 1210)
U14  DRV8811PWPR  [POW_MOTOR_DRV8811PWPR]  (parts A,B,C of 3)

### Blocks framed on the sheet
Motor driver: C166 C167 C169 C171-C174 Q2 R84 R85 R87-R92 U14
Drive power output + bulk capacitors: C168 C170 C175 J2 R86 R93 U14
Protection TVS: D21-D24

### Ports
MOT_DIR (in, see 4), MOT_ENA# (in, see 4), MOT_HOME (out, see 4), MOT_RESET# (in, see 4), MOT_SLP# (in, see 4), MOT_SR# (in, see 4), MOT_STEP (in, see 4), MOT_USM0 (in, see 4), MOT_USM1 (in, see 4)

### Nets
3V3D: C167.2 R84.2 R87.2 R88.2 R89.2 U14.10(VCC)
24V: C168.1 C169.2 C170.2 C175.2 U14.15(VMB) U14.28(VMA)
GND: C166.2 C167.1 C168.2 C170.1 C172.1 C173.1 C174.1 C175.1 D21.2 D22.2 D23.2 D24.2 Q2.2(S) R85.1 R86.1 R90.1 R91.1 R92.1 R93.1 U14.7(GND) U14.21(GND) U14.PAD(GND)
AOUT1: D21.1 J2.2 U14.4(AOUT1)
AOUT2: D22.1 J2.1 U14.25(AOUT2)
BOUT1: D23.1 J2.3 U14.11(BOUT1)
BOUT2: D24.1 J2.4 U14.18(BOUT2)
MOT_DIR: U14.3(DIR) ; port MOT_DIR
MOT_ENA#: U14.26(~{ENABLE}) ; port MOT_ENA#
MOT_HOME: Q2.3(D) R87.1 ; port MOT_HOME
MOT_HOME#: Q2.1(G) R88.1 U14.2(HOME)
MOT_RESET#: U14.17(~{RESET}) ; port MOT_RESET#
MOT_SLP#: U14.27(~{SLEEP}) ; port MOT_SLP#
MOT_SR#: U14.16(~{SR}) ; port MOT_SR#
MOT_STEP: U14.19(STEP) ; port MOT_STEP
MOT_USM0: U14.13(USM0) ; port MOT_USM0
MOT_USM1: U14.12(USM1) ; port MOT_USM1
NetC166_1: C166.1 U14.20(VGD)
NetC169_1: C169.1 U14.22(VCP)
NetC171_1: C171.1 U14.24(CP2)
NetC171_2: C171.2 U14.23(CP1)
NetC172_2: C172.2 R89.1 R90.2 U14.5(DECAY)
NetC173_2: C173.2 R91.2 U14.6(RCA)
NetC174_2: C174.2 R92.2 U14.9(RCB)
NetR84_1: R84.1 R85.2 U14.8(VREF)
NetR86_2: R86.2 U14.1(ISENA)
NetR93_2: R93.2 U14.14(ISENB)

### Notes on the sheet
- Design notes - DRV8811:
  - VCC = 3 to 5.5V
  - No decay mode specified. Mixed decay chosen (0.21*VCC< DECAY < 0.6*VCC) with common application values.
  - RESET# & ENA# are internally pulled high
  - All other inputs aure pulled low
  - MOT_HOME's logic levels could be incorrect for 3V3LVCMOS. It is therefore inverted and redriven
- Design notes DRV8811 - ISENSE:
  Current (per winding) = 1.9A
  1.9A = Vref / (8*Rsense)
  Rsense = 1.65V/(8 * 1.9A) = 108mOhm
  Rsense actual = 110mOhm
  Imax actual = 1.875A
- Current consumption
- PCB notes:
  Keep high current traces away from sensible nodes
- 8mA @ VMOT (24V)
- 4mA @ VCC (3V3)
- VDD needed
- 3.8A @ VMOT (24V)
- Sheet Name
- Project Title
- Global Project
- Size
- Group
- Revision
- Date
- Sheet
- of
- Filename
- Designers
- (in symbol CONN_TERMINAL_OSTTC040162) 5MM; TERMINAL BLOCK
- (in symbol POW_MOTOR_DRV8811PWPR, part A) Motor Driver Control Logic
- (in symbol POW_MOTOR_DRV8811PWPR, part B) Motor Driver A
- (in symbol POW_MOTOR_DRV8811PWPR, part C) Motor Driver B

### Library data of the parts
C166 C169 C171 = CAP - 0805: Mfg Part Number: CL21B224KBFNNNE; Precision: 10%; Current: *; CreatedBy: Jonathan Bouchard; Power: *
C167 = CAP - 0402: Precision: 10%; Current: *; CreatedBy: Jonathan Bouchard; Power: *
C168 = CAP_ALU_MAL215099101E3: CAP - ALU 100uF 20% 50V - 1010; Current: 490mA; Mfg: Vishay Dale; Mfg Part Number: MAL215099101E3; HelpURL: http://www.vishay.com/docs/28395/150crz.pdf; CreatedBy: Jonathan Bouchard; Temperature: -55°C to 125°C; Power: *; Supplier 1: Digikey; Supplier Part Number 1: 4399PHDKR-ND
C170 C173-C175 = CAP - 0402: Mfg: C1005X7R1H102K050BA; Precision: 10%; Current: *; CreatedBy: Jonathan Bouchard; Power: *
C172 = CAP - 0402: Mfg Part Number: CL05B104KO5NNNC; Precision: 10%; Current: *; CreatedBy: Jonathan Bouchard; Power: *
D21-D24 = TVS_PWR_SMBJ24CA: TVS - 24V 26.7V 600W - DO214AA; Manufacturer #1: Littelfuse Inc.; Value: Vbr = 26.7V -  Clamp = 38.9V; Voltage Rating: 24V Standoff; Current Rating: 15.5A; GRAMS Lib Spec: 2.8; Magnetic Material: UNKNOWN; Polarized: NO; Tolerance: *; Power Max: 600W; HelpURL: http://www.littelfuse.com/~/media/electronics/datasheets/tvs_diodes/littelfuse_tvs_diode_smbj_datasheet.pdf.pdf; CreatedBy/Date: Arnaud Samson - 06/07/18; VerifiedBy: Jonathan Bouchard - 2018-07-13; Temperature: -65°C ~ 150°C (TJ); Package: DO214AA; Manufacturer #2: *; Note: *; Assembly Type: SMD; Part Number #2: *; Part Number #1: SMBJ24CA; Supplier 1: Digi-Key; Supplier Part Number 1: SMBJ24CALFCT-ND; Cryo: UNKNOWN
J2 = CONN_TERMINAL_OSTTC040162: CONN -  TERMINAL BLOCK 4POS 5MM - TH; Mfg: On Shore Technology Inc.; Voltage: *; Current: *; Power: *; Mfg Part Number: OSTTC040162; HelpURL: http://www.on-shore.com/wp-content/uploads/2015/09/osttcxx0162.pdf; CreatedBy: Jonathan Bouchard; Temperature: -30°C ~ 105°C; Value: *; Precision: *; Package: TH-4; Supplier 1: Digikey; Supplier Part Number 1: ED2602-ND
Q2 = TRX_NMOS_SI2324A-TP: TRX - MOSFET N-CH 100V 2A - SOT-23; Manufacturer #1: Micro Commercial Co; Power Max: 350mW; Voltage rating: 100V (Vds max), 2V (Vgs @ 250uA); Polarized: Yes; Magnetic Material: UNKNOWN; Current Rating: 2A; Manufacturer #2: *; Value: *; Part Number #1: SI2324A-TP; Part Number #2: *; HelpURL: https://www.mccsemi.com/pdf/Products/SI2324A(SOT-23)-A.pdf; Supplier 1: Digi-Key; Supplier Part Number 1: SI2324A-TPMSCT-ND; Assembly Type: SMD; Temperature: -55°C ~ 150°C (TJ); Package: SOT-23; CreatedBy/Date: *; GRAMS Lib Spec: *; Tolerance: *; VerifiedBy: *; Cryo: *
R84 R85 R87-R92 = RES - 0402: Voltage: 50V; Power: 1/16W; Current: *; CreatedBy: Jonathan Bouchard
R86 R93 = RES - 1210: Power: 1/16W; Current: *; CreatedBy: Jonathan Bouchard
U14 = POW_MOTOR_DRV8811PWPR: POW - STEPPER MOTOR DRIVER - SOP-28; Voltage: 3 V ~ 5.5 V / 8 V ~ 38 V; Mfg: Texas Instrument; Current: *; Power: *; Mfg Part Number: DRV8811PWPR; HelpURL: http://www.ti.com/lit/ds/symlink/drv8811.pdf; CreatedBy: Jonathan Bouchard; Temperature: -40°C ~ 150°C (TJ); Value: *; Precision: *; Package: SOP-28; Supplier 1: Digikey; Supplier Part Number 1: 296-24591-1-ND

## Sheet S7CAS-PLEIADES-CARTE-MERE_P07_ETH.SchDoc
size Tabloid; DocumentNumber: 14; SheetNumber: 14; SheetTotal: 16; Sheet_Name: ETH; Size: 11x17
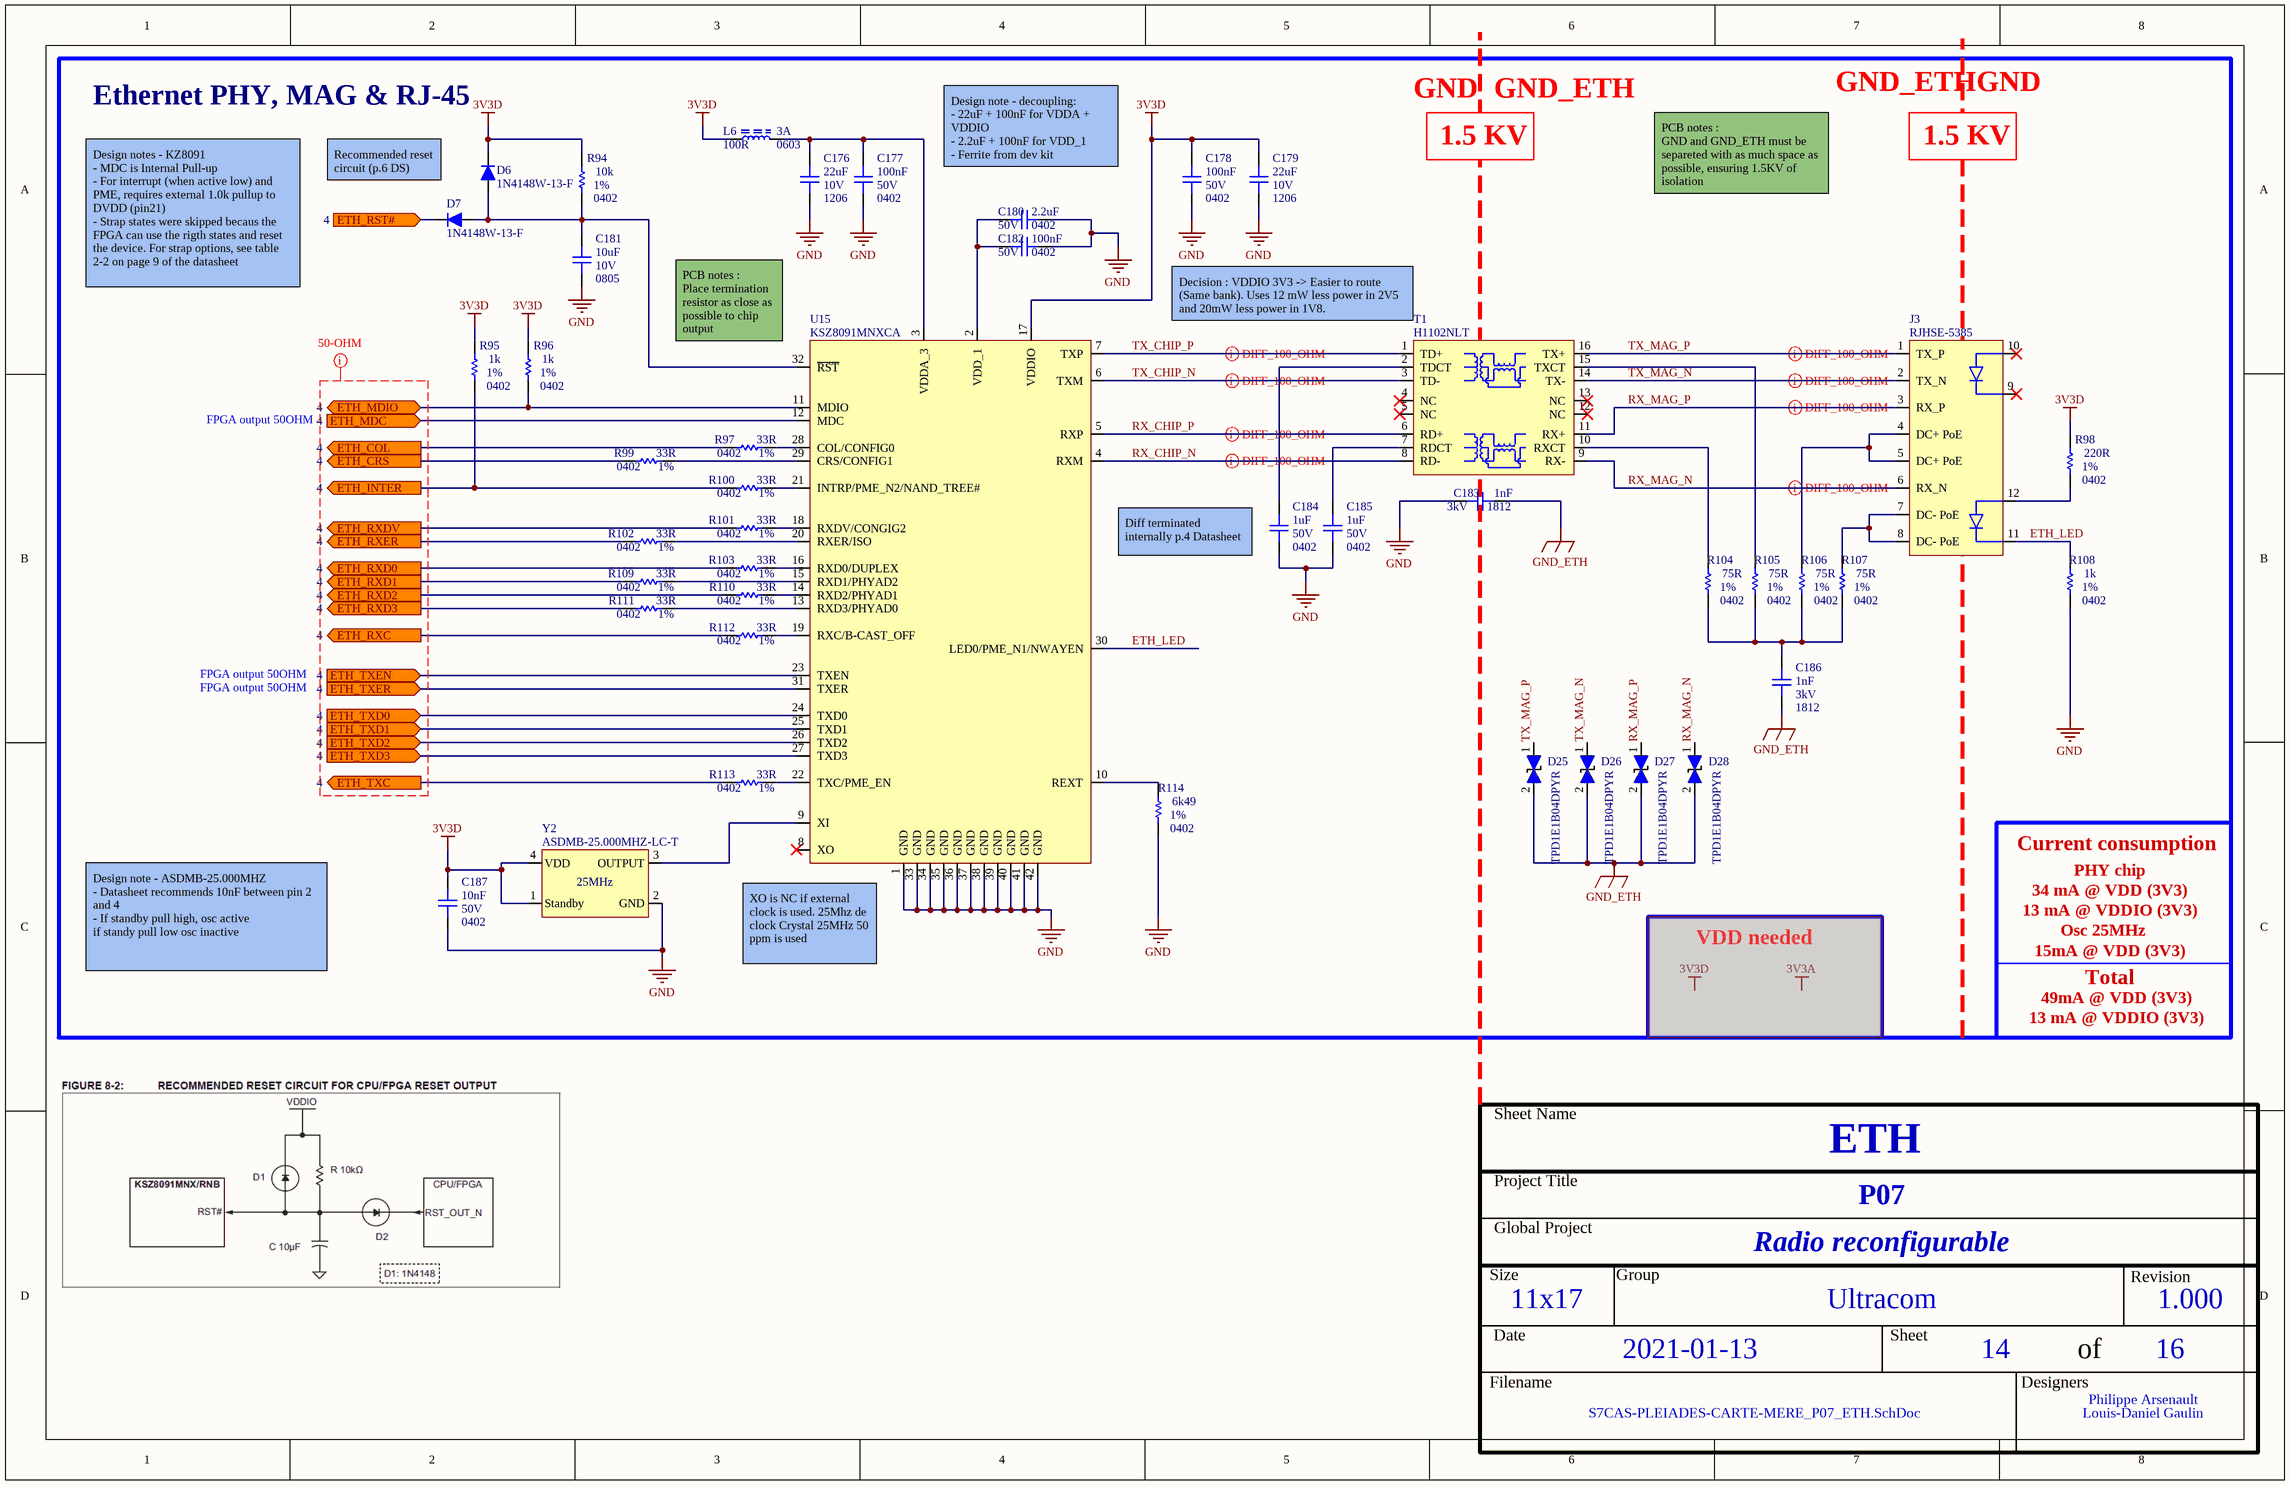
[diagram p13: S7CAS-PLEIADES-CARTE-MERE_P07_ETH.SchDoc]

### Parts
C176  value 22uF  Voltage: 10V  Package: 1206  [CAP_1206]  (hidden comment: CAP - 1206)
C177  value 100nF  Voltage: 50V  Package: 0402  [CAP_0402]  (hidden comment: CAP - 0402)
C178  value 100nF  Voltage: 50V  Package: 0402  [CAP_0402]  (hidden comment: CAP - 0402)
C179  value 22uF  Voltage: 10V  Package: 1206  [CAP_1206]  (hidden comment: CAP - 1206)
C180  value 2.2uF  Voltage: 50V  Package: 0402  [CAP_0402]  (hidden comment: CAP - 0402)
C181  value 10uF  Voltage: 10V  Package: 0805  [CAP_0805]  (hidden comment: CAP - 0805)
C182  value 100nF  Voltage: 50V  Package: 0402  [CAP_0402]  (hidden comment: CAP - 0402)
C183  value 1nF  Voltage: 3kV  Package: 1812  [CAP_1812]  (hidden comment: CAP - 1812)
C184  value 1uF  Voltage: 50V  Package: 0402  [CAP_0402]  (hidden comment: CAP - 0402)
C185  value 1uF  Voltage: 50V  Package: 0402  [CAP_0402]  (hidden comment: CAP - 0402)
C186  value 1nF  Voltage: 3kV  Package: 1812  [CAP_1812]  (hidden comment: CAP - 1812)
C187  value 10nF  Voltage: 50V  Package: 0402  [CAP_0402]  (hidden comment: CAP - 0402)
D6  1N4148W-13-F  [SOD123_DIO]
D7  1N4148W-13-F  [SOD123_DIO]
D25  TPD1E1B04DPYR  [TVS_DATA_TPD1E1B04DPYR]
D26  TPD1E1B04DPYR  [TVS_DATA_TPD1E1B04DPYR]
D27  TPD1E1B04DPYR  [TVS_DATA_TPD1E1B04DPYR]
D28  TPD1E1B04DPYR  [TVS_DATA_TPD1E1B04DPYR]
J3  RJHSE-5385  [CONN_ETHERNET_RJHSE-5385]
L6  value 100R  Current: 3A  Package: 0603  [FER_0603]  (hidden comment: FER - 0603)
R94  value 10k  Package: 0402  Precision: 1%  [RES_0402]  (hidden comment: RES - 0402)
R95  value 1k  Package: 0402  Precision: 1%  [RES_0402]  (hidden comment: RES - 0402)
R96  value 1k  Package: 0402  Precision: 1%  [RES_0402]  (hidden comment: RES - 0402)
R97  value 33R  Package: 0402  Precision: 1%  [RES_0402]  (hidden comment: RES - 0402)
R98  value 220R  Package: 0402  Precision: 1%  [RES_0402]  (hidden comment: RES - 0402)
R99  value 33R  Package: 0402  Precision: 1%  [RES_0402]  (hidden comment: RES - 0402)
R100  value 33R  Package: 0402  Precision: 1%  [RES_0402]  (hidden comment: RES - 0402)
R101  value 33R  Package: 0402  Precision: 1%  [RES_0402]  (hidden comment: RES - 0402)
R102  value 33R  Package: 0402  Precision: 1%  [RES_0402]  (hidden comment: RES - 0402)
R103  value 33R  Package: 0402  Precision: 1%  [RES_0402]  (hidden comment: RES - 0402)
R104  value 75R  Package: 0402  Precision: 1%  [RES_0402]  (hidden comment: RES - 0402)
R105  value 75R  Package: 0402  Precision: 1%  [RES_0402]  (hidden comment: RES - 0402)
R106  value 75R  Package: 0402  Precision: 1%  [RES_0402]  (hidden comment: RES - 0402)
R107  value 75R  Package: 0402  Precision: 1%  [RES_0402]  (hidden comment: RES - 0402)
R108  value 1k  Package: 0402  Precision: 1%  [RES_0402]  (hidden comment: RES - 0402)
R109  value 33R  Package: 0402  Precision: 1%  [RES_0402]  (hidden comment: RES - 0402)
R110  value 33R  Package: 0402  Precision: 1%  [RES_0402]  (hidden comment: RES - 0402)
R111  value 33R  Package: 0402  Precision: 1%  [RES_0402]  (hidden comment: RES - 0402)
R112  value 33R  Package: 0402  Precision: 1%  [RES_0402]  (hidden comment: RES - 0402)
R113  value 33R  Package: 0402  Precision: 1%  [RES_0402]  (hidden comment: RES - 0402)
R114  value 6k49  Package: 0402  Precision: 1%  [RES_0402]  (hidden comment: RES - 0402)
T1  H1102NLT  [TRANSFO_H1102NLT]
U15  KSZ8091MNXCA  [COM_ETH_PHY_KSZ8091MNXCA]
Y2  ASDMB-25.000MHZ-LC-T  [OSC_ASDMB-25.000MHZ-LC-T]

### Ports
ETH_COL (out, see 4), ETH_CRS (out, see 4), ETH_INTER (out, see 4), ETH_MDC (in, see 4), ETH_MDIO (bidir, see 4), ETH_RST# (in, see 4), ETH_RXC (out, see 4), ETH_RXD0 (out, see 4), ETH_RXD1 (out, see 4), ETH_RXD2 (out, see 4), ETH_RXD3 (out, see 4), ETH_RXDV (out, see 4), ETH_RXER (out, see 4), ETH_TXC (out, see 4), ETH_TXD0 (in, see 4), ETH_TXD1 (in, see 4), ETH_TXD2 (in, see 4), ETH_TXD3 (in, see 4), ETH_TXEN (in, see 4), ETH_TXER (in, see 4)

### Nets
3V3D: C178.2 C179.2 C187.2 D6.1 L6.2 R94.2 R95.2 R96.2 R98.2 U15.17(VDDIO) Y2.1(Standby) Y2.4(VDD)
GND: C176.1 C177.1 C178.1 C179.1 C180.1 C181.1 C182.1 C183.2 C184.1 C185.1 C187.1 R108.1 R114.1 U15.1(GND) U15.33(GND) U15.34(GND) U15.35(GND) U15.36(GND) U15.37(GND) U15.38(GND) U15.39(GND) U15.40(GND) U15.41(GND) U15.42(GND) Y2.2(GND)
GND_ETH: C183.1 C186.2 D25.2(i/o) D26.2(i/o) D27.2(i/o) D28.2(i/o)
ETH_COL: R97.2 ; port ETH_COL
ETH_CRS: R99.2 ; port ETH_CRS
ETH_INTER: R95.1 R100.2 ; port ETH_INTER
ETH_LED: J3.11(LED2_K) R108.2 U15.30(LED0/PME_N1/NWAYEN)
ETH_MDC: U15.12(MDC) ; port ETH_MDC
ETH_MDIO: R96.1 U15.11(MDIO) ; port ETH_MDIO
ETH_RST#: D7.1 ; port ETH_RST#
ETH_RXC: R112.2 ; port ETH_RXC
ETH_RXD0: R103.2 ; port ETH_RXD0
ETH_RXD1: R109.2 ; port ETH_RXD1
ETH_RXD2: R110.2 ; port ETH_RXD2
ETH_RXD3: R111.2 ; port ETH_RXD3
ETH_RXDV: R101.2 ; port ETH_RXDV
ETH_RXER: R102.2 ; port ETH_RXER
ETH_TXC: R113.2 ; port ETH_TXC
ETH_TXD0: U15.24(TXD0) ; port ETH_TXD0
ETH_TXD1: U15.25(TXD1) ; port ETH_TXD1
ETH_TXD2: U15.26(TXD2) ; port ETH_TXD2
ETH_TXD3: U15.27(TXD3) ; port ETH_TXD3
ETH_TXEN: U15.23(TXEN) ; port ETH_TXEN
ETH_TXER: U15.31(TXER) ; port ETH_TXER
RX_CHIP_N: T1.8(RD-) U15.4(RXM)
RX_CHIP_P: T1.6(RD+) U15.5(RXP)
RX_MAG_N: D28.1(i/o) J3.6(RX_N) T1.9(RX-)
RX_MAG_P: D27.1(i/o) J3.3(RX_P) T1.11(RX+)
TX_CHIP_N: T1.3(TD-) U15.6(TXM)
TX_CHIP_P: T1.1(TD+) U15.7(TXP)
TX_MAG_N: D26.1(i/o) J3.2(TX_N) T1.14(TX-)
TX_MAG_P: D25.1(i/o) J3.1(TX_P) T1.16(TX+)
NetC176_2: C176.2 C177.2 L6.1 U15.3(VDDA_3)
NetC180_2: C180.2 C182.2 U15.2(VDD_1)
NetC181_2: C181.2 D6.2 D7.2 R94.1 U15.32(~{RST})
NetC184_2: C184.2 T1.2(TDCT)
NetC185_2: C185.2 T1.7(RDCT)
NetC186_1: C186.1 R104.1 R105.1 R106.1 R107.1
NetJ3_4: J3.4(DC+_PoE) J3.5(DC+_PoE) R106.2
NetJ3_7: J3.7(DC-_PoE) J3.8(DC-_PoE) R107.2
NetJ3_12: J3.12(LED2_A) R98.1
NetR97_1: R97.1 U15.28(COL/CONFIG0)
NetR99_1: R99.1 U15.29(CRS/CONFIG1)
NetR100_1: R100.1 U15.21(INTRP/PME_N2/NAND_TREE#)
NetR101_1: R101.1 U15.18(RXDV/CONGIG2)
NetR102_1: R102.1 U15.20(RXER/ISO)
NetR103_1: R103.1 U15.16(RXD0/DUPLEX)
NetR104_2: R104.2 T1.10(RXCT)
NetR105_2: R105.2 T1.15(TXCT)
NetR109_1: R109.1 U15.15(RXD1/PHYAD2)
NetR110_1: R110.1 U15.14(RXD2/PHYAD1)
NetR111_1: R111.1 U15.13(RXD3/PHYAD0)
NetR112_1: R112.1 U15.19(RXC/B-CAST_OFF)
NetR113_1: R113.1 U15.22(TXC/PME_EN)
NetR114_2: R114.2 U15.10(REXT)
NetU15_9: U15.9(XI) Y2.3(OUTPUT)

Not connected (* = marked no-connect by the designer): J3 9(LED1_K)* 10(LED1_A)*; T1 4(NC)* 5(NC)* 12(NC)* 13(NC)*; U15 8(XO)*

### Layout directives
differential pair; net class DIFF_100_OHM; differential pair class DIFF_100_OHM: RX_CHIP_N, RX_CHIP_P, RX_MAG_N, RX_MAG_P, TX_CHIP_N, TX_CHIP_P, TX_MAG_N, TX_MAG_P
net class SE_50OHM; net class ETH: (no net found under the mark)

### Notes on the sheet
- GND_ETH
- GND
- Ethernet PHY, MAG & RJ-45
- Design note - decoupling:
  - 22uF + 100nF for VDDA + VDDIO
  - 2.2uF + 100nF for VDD_1
  - Ferrite from dev kit
- 1.5 KV
- Recommended reset circuit (p.6 DS)
- PCB notes :
  GND and GND_ETH must be separeted with as much space as possible, ensuring 1.5KV of isolation
- Design notes - KZ8091
  - MDC is Internal Pull-up
  - For interrupt (when active low) and PME, requires external 1.0k pullup to DVDD (pin21)
  - Strap states were skipped becaus the FPGA can use the rigth states and reset the device. For strap options, see table 2-2 on page 9 of the datasheet
- (near U15) PCB notes :
  Place termination resistor as close as possible to chip output
- (near T1) Decision : VDDIO 3V3 -> Easier to route (Same bank). Uses 12 mW less power in 2V5 and 20mW less power in 1V8.
- FPGA output 50OHM
- Diff terminated internally p.4 Datasheet
- Current consumption
- PHY chip
- 34 mA @ VDD (3V3)
- Design note - ASDMB-25.000MHZ
  - Datasheet recommends 10nF between pin 2 and 4
  - If standby pull high, osc active
  if standy pull low osc inactive
- (near U15) XO is NC if external clock is used. 25Mhz de clock Crystal 25MHz 50 ppm is used
- VDD needed
- Osc 25MHz
- 13 mA @ VDDIO (3V3)
- 15mA @ VDD (3V3)
- Total
- 49mA @ VDD (3V3)
- Sheet Name
- Project Title
- Global Project
- Size
- Group
- Revision
- Date
- Sheet
- of
- Filename
- Designers

### Library data of the parts
C176 C179 = CAP - 1206: Precision: 10%; Current: *; CreatedBy: Jonathan Bouchard; Power: *
C177 C178 C180 C182 C184 C185 C187 = CAP - 0402: Precision: 10%; Current: *; CreatedBy: Jonathan Bouchard; Power: *
C181 = CAP - 0805: Mfg: CL21B106KPQNNNE; Precision: 10%; Current: *; CreatedBy: Jonathan Bouchard; Power: *
C183 C186 = CAP - 1812: Mfg Part Number: 1812HC102MAT1A; Precision: 10%; Current: *; CreatedBy: Jonathan Bouchard; Power: *
D6 D7 = DIO_1N4148W-13-F: 1N4148; Vendor: Diodes Inc; Built_By: EMA_UL_Team; SourceLibrary: DiodesInc_2015-05-08; Type: DEV; Manufacturer_Part_Number: 1N4148W-13-F; Copyright: Copyright (C) 2018 Accelerated Designs. All rights reserved; RefDes: RefDes
D25-D28 = TVS_DATA_TPD1E1B04DPYR: TVS - TVS DIODE 3.6V 8.5V - 0402; Manufacturer #1: Texas Instruments; Current Rating: 6.3Apeak; Power Max: 50Wpeak; GRAMS Lib Spec: 2.8; Magnetic Material: Unknown; Polarized: No; Value: *; Tolerance: *; Voltage Rating: 3.6V; HelpURL: http://www.ti.com/lit/ds/symlink/tpd1e1b04.pdf; CreatedBy/Date: Keven Deslandes - 2018/10/19; VerifiedBy: Caroline Paulin - 28 janv 2019; Temperature: -40°C ~ 125°C (TA); Package: 0402; Manufacturer #2: *; Note: *; Assembly Type: SMD; Part Number #2: *; Part Number #1: TPD1E1B04DPYR; Supplier 1: Digi-Key; Supplier Part Number 1: 296-47364-1-ND; Cryo: UNKNOWN
J3 = CONN_ETHERNET_RJHSE-5385: CONN - MOD JACK RJ45 R/A ETHERNET - TH; Mfg: Amphenol; Voltage: *; Current: *; Power: *; Mfg Part Number: RJHSE-5385; HelpURL: https://www.amphenolcanada.com/ProductSearch/drawings/AC/RJHSE538X.pdf; CreatedBy: Jonathan Bouchard; Temperature: -55°C ~ 85°C; Value: *; Precision: *; Package: TH-12; Supplier 1: Digikey; Supplier Part Number 1: RJHSE-5385-ND
R94-R114 = RES - 0402: Voltage: 50V; Power: 1/16W; Current: *; CreatedBy: Jonathan Bouchard
T1 = TRANSFO_H1102NLT: TRANSFO - ETHERNET 10/100B-TX - SMD-16; Mfg: Pulse Eng.; Value: 1:1 (350uH); Voltage: *; Current: *; Power: *; Mfg Part Number: H1102NLT; HelpURL: http://media.digikey.com/pdf/Data%20Sheets/Pulse%20PDFs/10_100BASE-T%20Single%20Port%20SMD%20Magnetics_Rev2008.pdf; CreatedBy: Jonathan Bouchard; Temperature: -40°C to 85°C; Precision: *; Package: SMD-16; Supplier 1: Digikey; Supplier Part Number 1: 553-1532-1-ND
U15 = COM_ETH_PHY_KSZ8091MNXCA: COM - ETHERNET PHY 10/100 - QFN-32; Voltage: 1.8V, 2.5V, 3.3V; Mfg: Micrel; Current: *; Power: *; Mfg Part Number: KSZ8091MNXCA; HelpURL: http://ww1.microchip.com/downloads/en/DeviceDoc/00002275A.pdf; CreatedBy: Jonathan Bouchard; Temperature: 0°C ~ 70°C; Value: *; Precision: *; Package: QFN-32; Supplier 1: Digikey; Supplier Part Number 1: 576-4356-ND
Y2 = OSC_ASDMB-25.000MHZ-LC-T: OSC - 25MHz XO (Standard) LVCMOS - 4-SMD, No Lead; Manufacturer #1: Abracon LLC; Tolerance: ±50ppm; Voltage Rating: 1.8V ~ 3.3V; GRAMS Lib Spec: 2.8; Magnetic Material: Unknown; Polarized: Yes; Value: 25MHz; Current Rating: *; Power Max: *; HelpURL: https://abracon.com/Oscillators/ASDMB.pdf; CreatedBy/Date: Joël Lemay 2019-03-29; VerifiedBy: C. Paulin - 29 mai 2019; Temperature: -40°C ~ +85°C; Package: 4-SMD, No Lead; Manufacturer #2: *; Note: *; Assembly Type: SMD; Part Number #2: *; Part Number #1: ASDMB-25.000MHZ-LC-T; Supplier 1: Digi-Key; Supplier Part Number 1: 535-11730-1-ND; Cryo: UNKNOWN
L6 = FER - 0603: Voltage: *; CreatedBy: Jonathan Bouchard; Power: *; Precision: *